# EAGLE design UMN_HASP_2015_Front_End_Board2 (EAGLE 6.5.0)

## Sheet 1 of 6: Channel 1
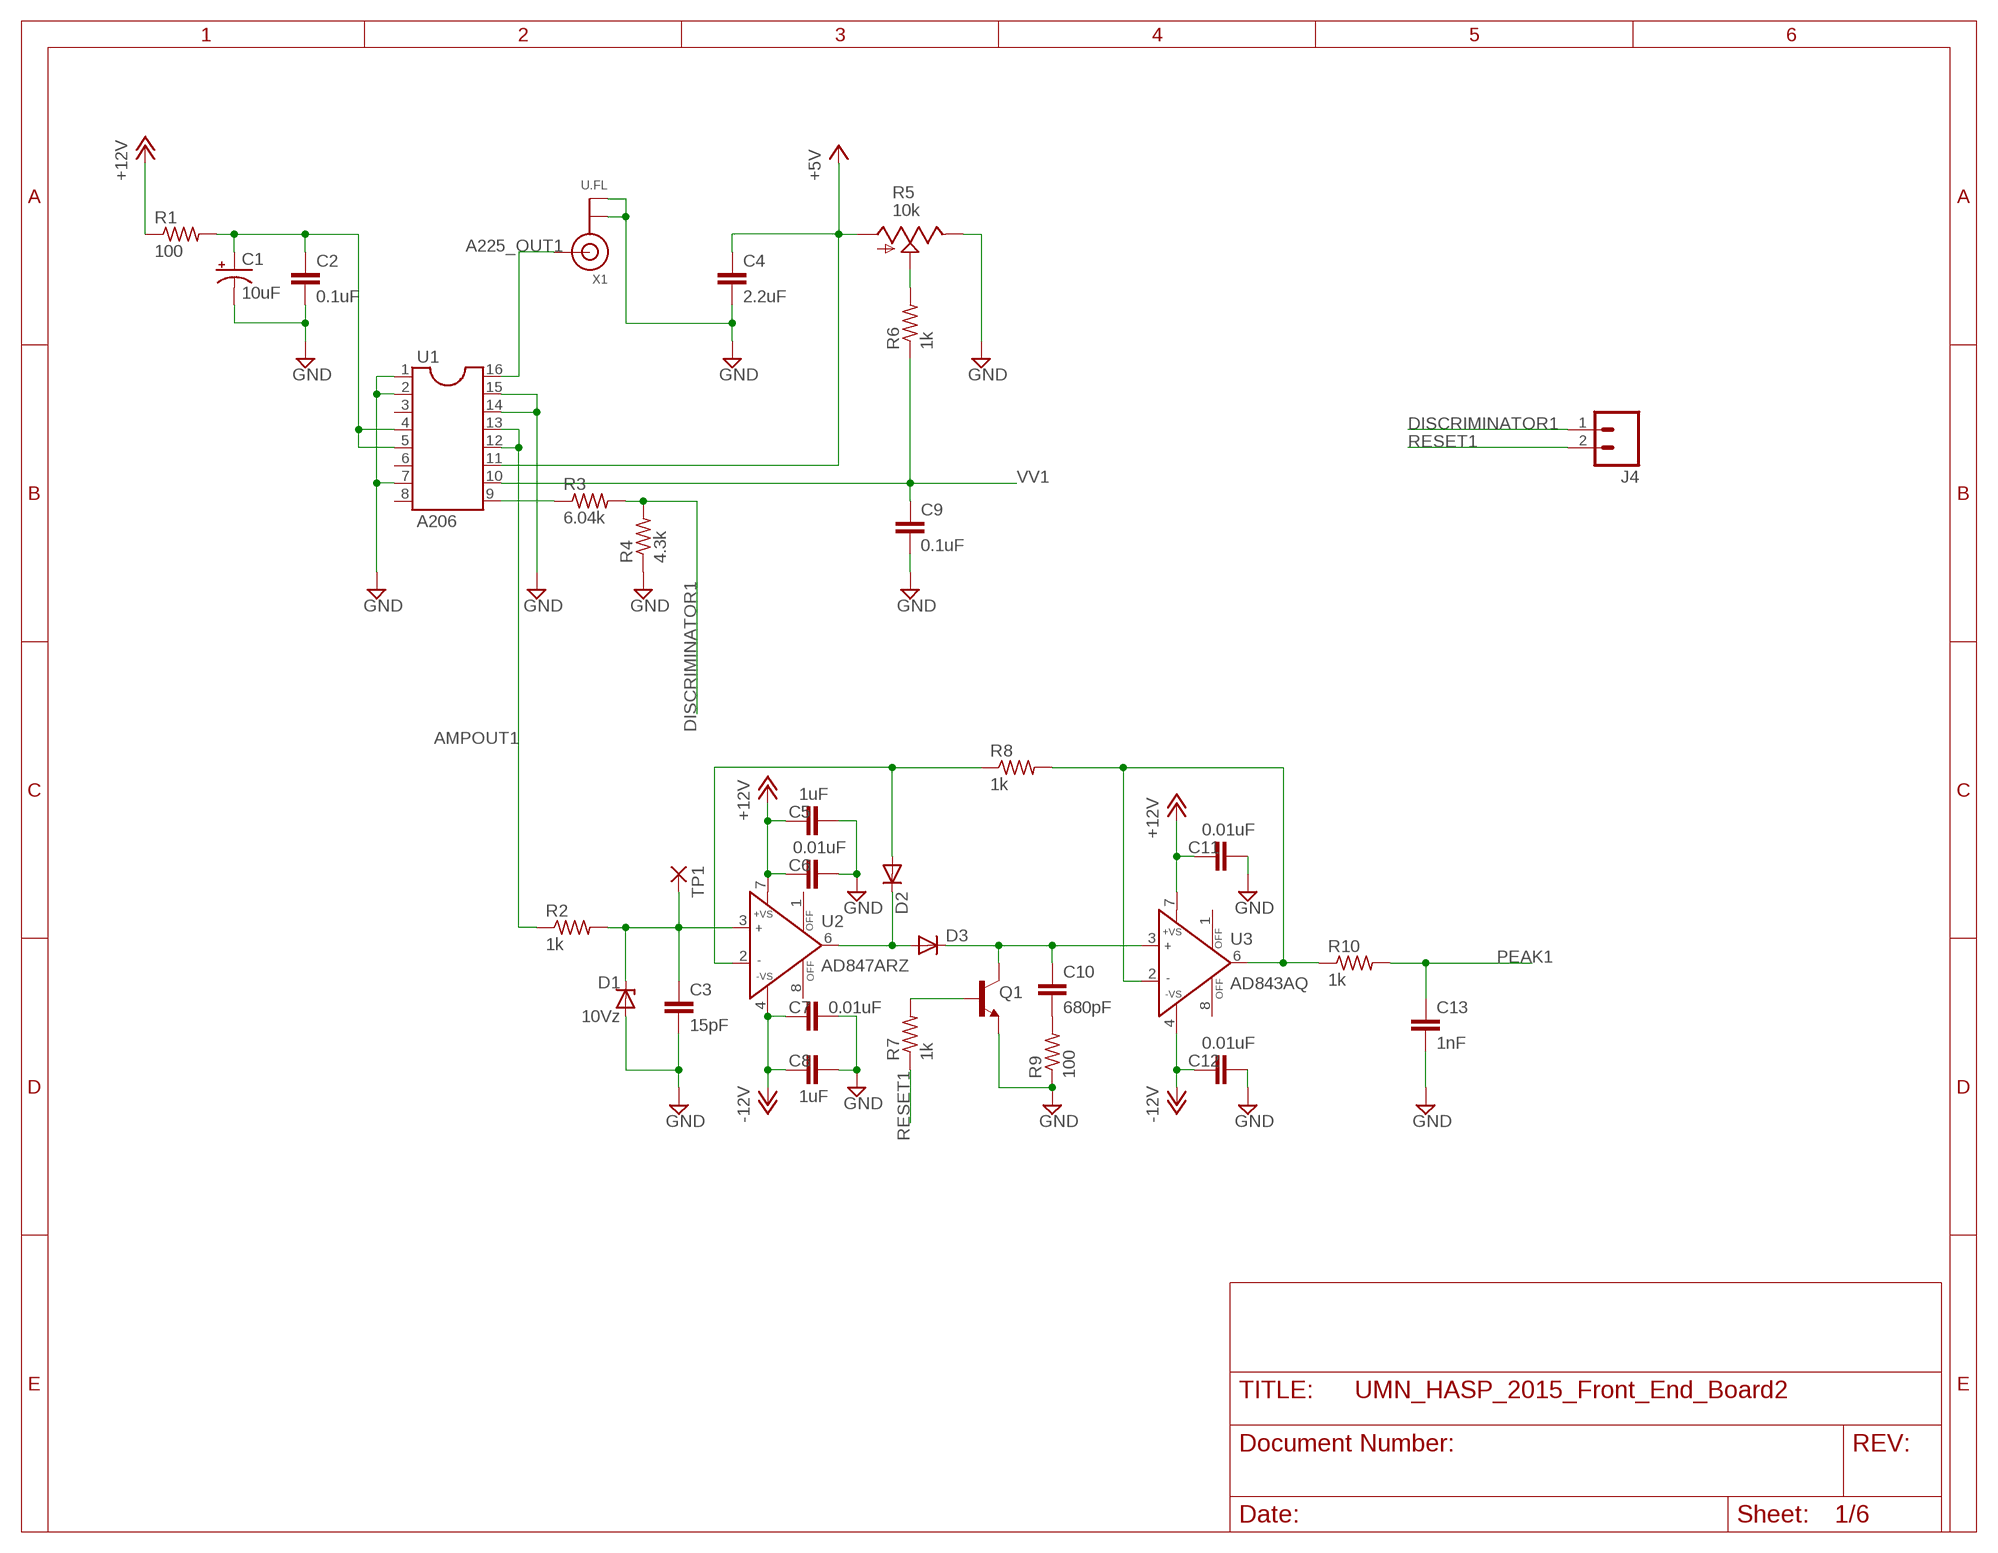
[diagram p0: schematic, sheet 1]

### Parts
C1  10uF  CPOL-USC/6032-28R  [C/6032-28R]
C2  0.1uF  C-EUC0603K  [C0603K]
C3  15pF  C-EUC0402K  [C0402K]
C4  2.2uF  C-EUC0603K  [C0603K]
C5  1uF  C-EUC0603K  [C0603K]
C6  0.01uF  C-EUC0402K  [C0402K]
C7  0.01uF  C-EUC0402K  [C0402K]
C8  1uF  C-EUC0603K  [C0603K]
C9  0.1uF  C-EUC0603K  [C0603K]
C10  680pF  C-EUC0402K  [C0402K]
C11  0.01uF  C-EUC0402K  [C0402K]
C12  0.01uF  C-EUC0402K  [C0402K]
C13  1nF  C-EUC0402K  [C0402K]
D1  10Vz  ZENER-DIODESOT23  [SOT23]
D2  DIODE-SOD323-R  [SOD323-R]
D3  DIODE-SOD323-R  [SOD323-R]
J4  M02PTH  [1X02]
Q1  -NPN-SOT23-EBC  [SOT23-EBC]
R1  100  R-US_R0603  [R0603]
R2  1k  R-US_R0603  [R0603]
R3  6.04k  R-US_R0603  [R0603]
R4  4.3k  R-US_R0603  [R0603]
R5  10k  TRIM_US-3223J  [3223J]
R6  1k  R-US_R0603  [R0603]
R7  1k  R-US_R0603  [R0603]
R8  1k  R-US_R0603  [R0603]
R9  100  R-US_R0603  [R0603]
R10  1k  R-US_R0402  [R0402]
TP1  SMD2  [SMD1,27-2,54]
U1  A206  DIL16S  [SOCKET-16]
U2  AD847ARZ  [SO8]
U3  AD843AQ  [DIL08]
X1  U.FL  ANTENNA_U.FL  [U.FL]

### Nets
+5V: C4.1 R5.1(A) U1.11 ; also sheet 2,3,4,5,6
+12V: C5.1 C6.1 C11.1 R1.1 U2.7(+VS) U3.7(+VS) ; also sheet 2,3,4,5,6
-12V: C7.1 C8.1 C12.1 U2.4(-VS) U3.4(-VS) ; also sheet 2,3,4,6
A225_OUT1: U1.16 X1.3(SIGNAL)
AMPOUT1: R2.1 U1.12 U1.13
DISCRIMINATOR1: J4.1 R3.2 R4.2
GND: C1.- C2.2 C3.2 C4.2 C5.2 C6.2 C7.2 C8.2 C9.2 C11.2 C12.2 C13.2 D1.1(A) Q1.E R4.1 R5.3(E) R9.1 U1.1 U1.2 U1.7 U1.14 U1.15 X1.1(GND) X1.2(GND) ; also sheet 2,3,4,5,6
N$9: C1.+ C2.1 R1.2 U1.4 U1.5
N$11: C3.1 D1.3(C) R2.2 TP1.1(P) U2.3(IN+)
N$12: R3.1 U1.9
N$13: D2.C D3.A U2.6(OUT)
N$14: R5.2(S) R6.2
N$15: D2.A R8.1 U2.2(IN-)
N$16: C10.1 D3.C Q1.C U3.3(IN+)
N$17: C10.2 R9.2
N$18: Q1.B R7.2
N$19: R8.2 R10.1 U3.2(IN-) U3.6(OUT)
PEAK1: C13.1 R10.2 ; also sheet 5
RESET1: J4.2 R7.1
VV1: C9.1 R6.1 U1.10
Unconnected: U1.3 U1.6 U1.8 U2.1(OFF) U2.8(OFF) U3.1(OFF) U3.8(OFF)

## Sheet 2 of 6: Channel 2
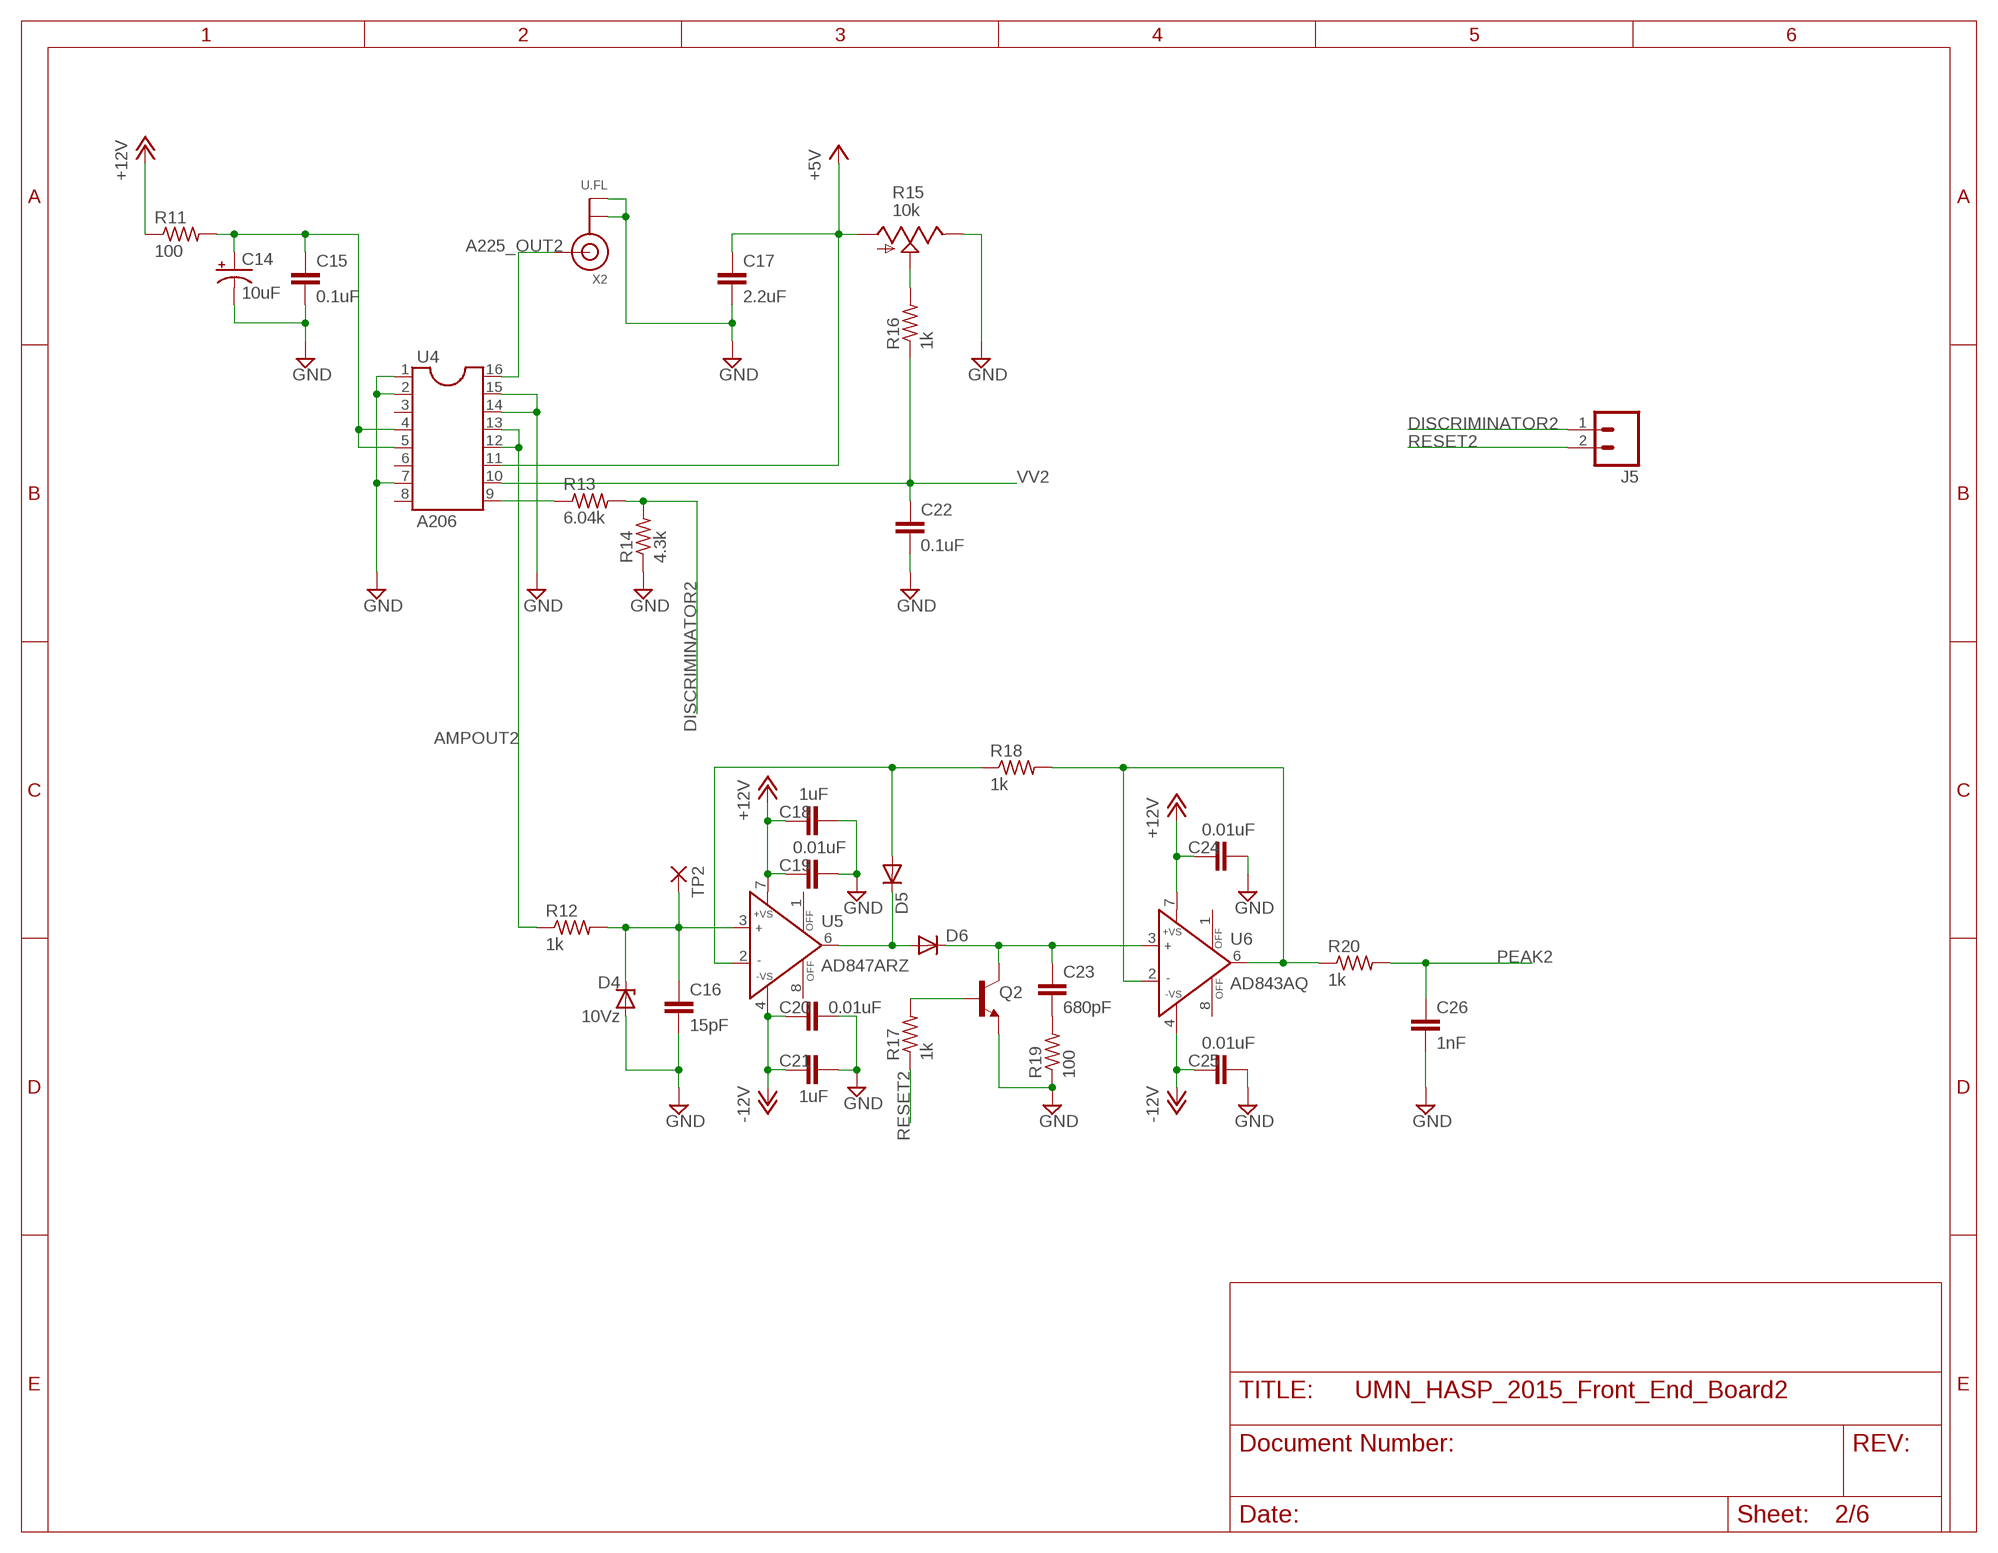
[diagram p1: schematic, sheet 2]

### Parts
C14  10uF  CPOL-USC/6032-28R  [C/6032-28R]
C15  0.1uF  C-EUC0603K  [C0603K]
C16  15pF  C-EUC0402K  [C0402K]
C17  2.2uF  C-EUC0603K  [C0603K]
C18  1uF  C-EUC0603K  [C0603K]
C19  0.01uF  C-EUC0402K  [C0402K]
C20  0.01uF  C-EUC0402K  [C0402K]
C21  1uF  C-EUC0603K  [C0603K]
C22  0.1uF  C-EUC0603K  [C0603K]
C23  680pF  C-EUC0402K  [C0402K]
C24  0.01uF  C-EUC0402K  [C0402K]
C25  0.01uF  C-EUC0402K  [C0402K]
C26  1nF  C-EUC0402K  [C0402K]
D4  10Vz  ZENER-DIODESOT23  [SOT23]
D5  DIODE-SOD323-R  [SOD323-R]
D6  DIODE-SOD323-R  [SOD323-R]
J5  M02PTH  [1X02]
Q2  -NPN-SOT23-EBC  [SOT23-EBC]
R11  100  R-US_R0603  [R0603]
R12  1k  R-US_R0603  [R0603]
R13  6.04k  R-US_R0603  [R0603]
R14  4.3k  R-US_R0603  [R0603]
R15  10k  TRIM_US-3223J  [3223J]
R16  1k  R-US_R0603  [R0603]
R17  1k  R-US_R0603  [R0603]
R18  1k  R-US_R0603  [R0603]
R19  100  R-US_R0603  [R0603]
R20  1k  R-US_R0402  [R0402]
TP2  SMD2  [SMD1,27-2,54]
U4  A206  DIL16S  [SOCKET-16]
U5  AD847ARZ  [SO8]
U6  AD843AQ  [DIL08]
X2  U.FL  ANTENNA_U.FL  [U.FL]

### Nets
+5V: C17.1 R15.1(A) U4.11 ; also sheet 1,3,4,5,6
+12V: C18.1 C19.1 C24.1 R11.1 U5.7(+VS) U6.7(+VS) ; also sheet 1,3,4,5,6
-12V: C20.1 C21.1 C25.1 U5.4(-VS) U6.4(-VS) ; also sheet 1,3,4,6
A225_OUT2: U4.16 X2.3(SIGNAL)
AMPOUT2: R12.1 U4.12 U4.13
DISCRIMINATOR2: J5.1 R13.2 R14.2
GND: C14.- C15.2 C16.2 C17.2 C18.2 C19.2 C20.2 C21.2 C22.2 C24.2 C25.2 C26.2 D4.1(A) Q2.E R14.1 R15.3(E) R19.1 U4.1 U4.2 U4.7 U4.14 U4.15 X2.1(GND) X2.2(GND) ; also sheet 1,3,4,5,6
N$1: C14.+ C15.1 R11.2 U4.4 U4.5
N$2: R13.1 U4.9
N$3: R15.2(S) R16.2
N$20: C16.1 D4.3(C) R12.2 TP2.1(P) U5.3(IN+)
N$21: D5.C D6.A U5.6(OUT)
N$22: D5.A R18.1 U5.2(IN-)
N$23: C23.1 D6.C Q2.C U6.3(IN+)
N$24: C23.2 R19.2
N$25: Q2.B R17.2
N$26: R18.2 R20.1 U6.2(IN-) U6.6(OUT)
PEAK2: C26.1 R20.2 ; also sheet 5
RESET2: J5.2 R17.1
VV2: C22.1 R16.1 U4.10
Unconnected: U4.3 U4.6 U4.8 U5.1(OFF) U5.8(OFF) U6.1(OFF) U6.8(OFF)

## Sheet 3 of 6: Channel 3
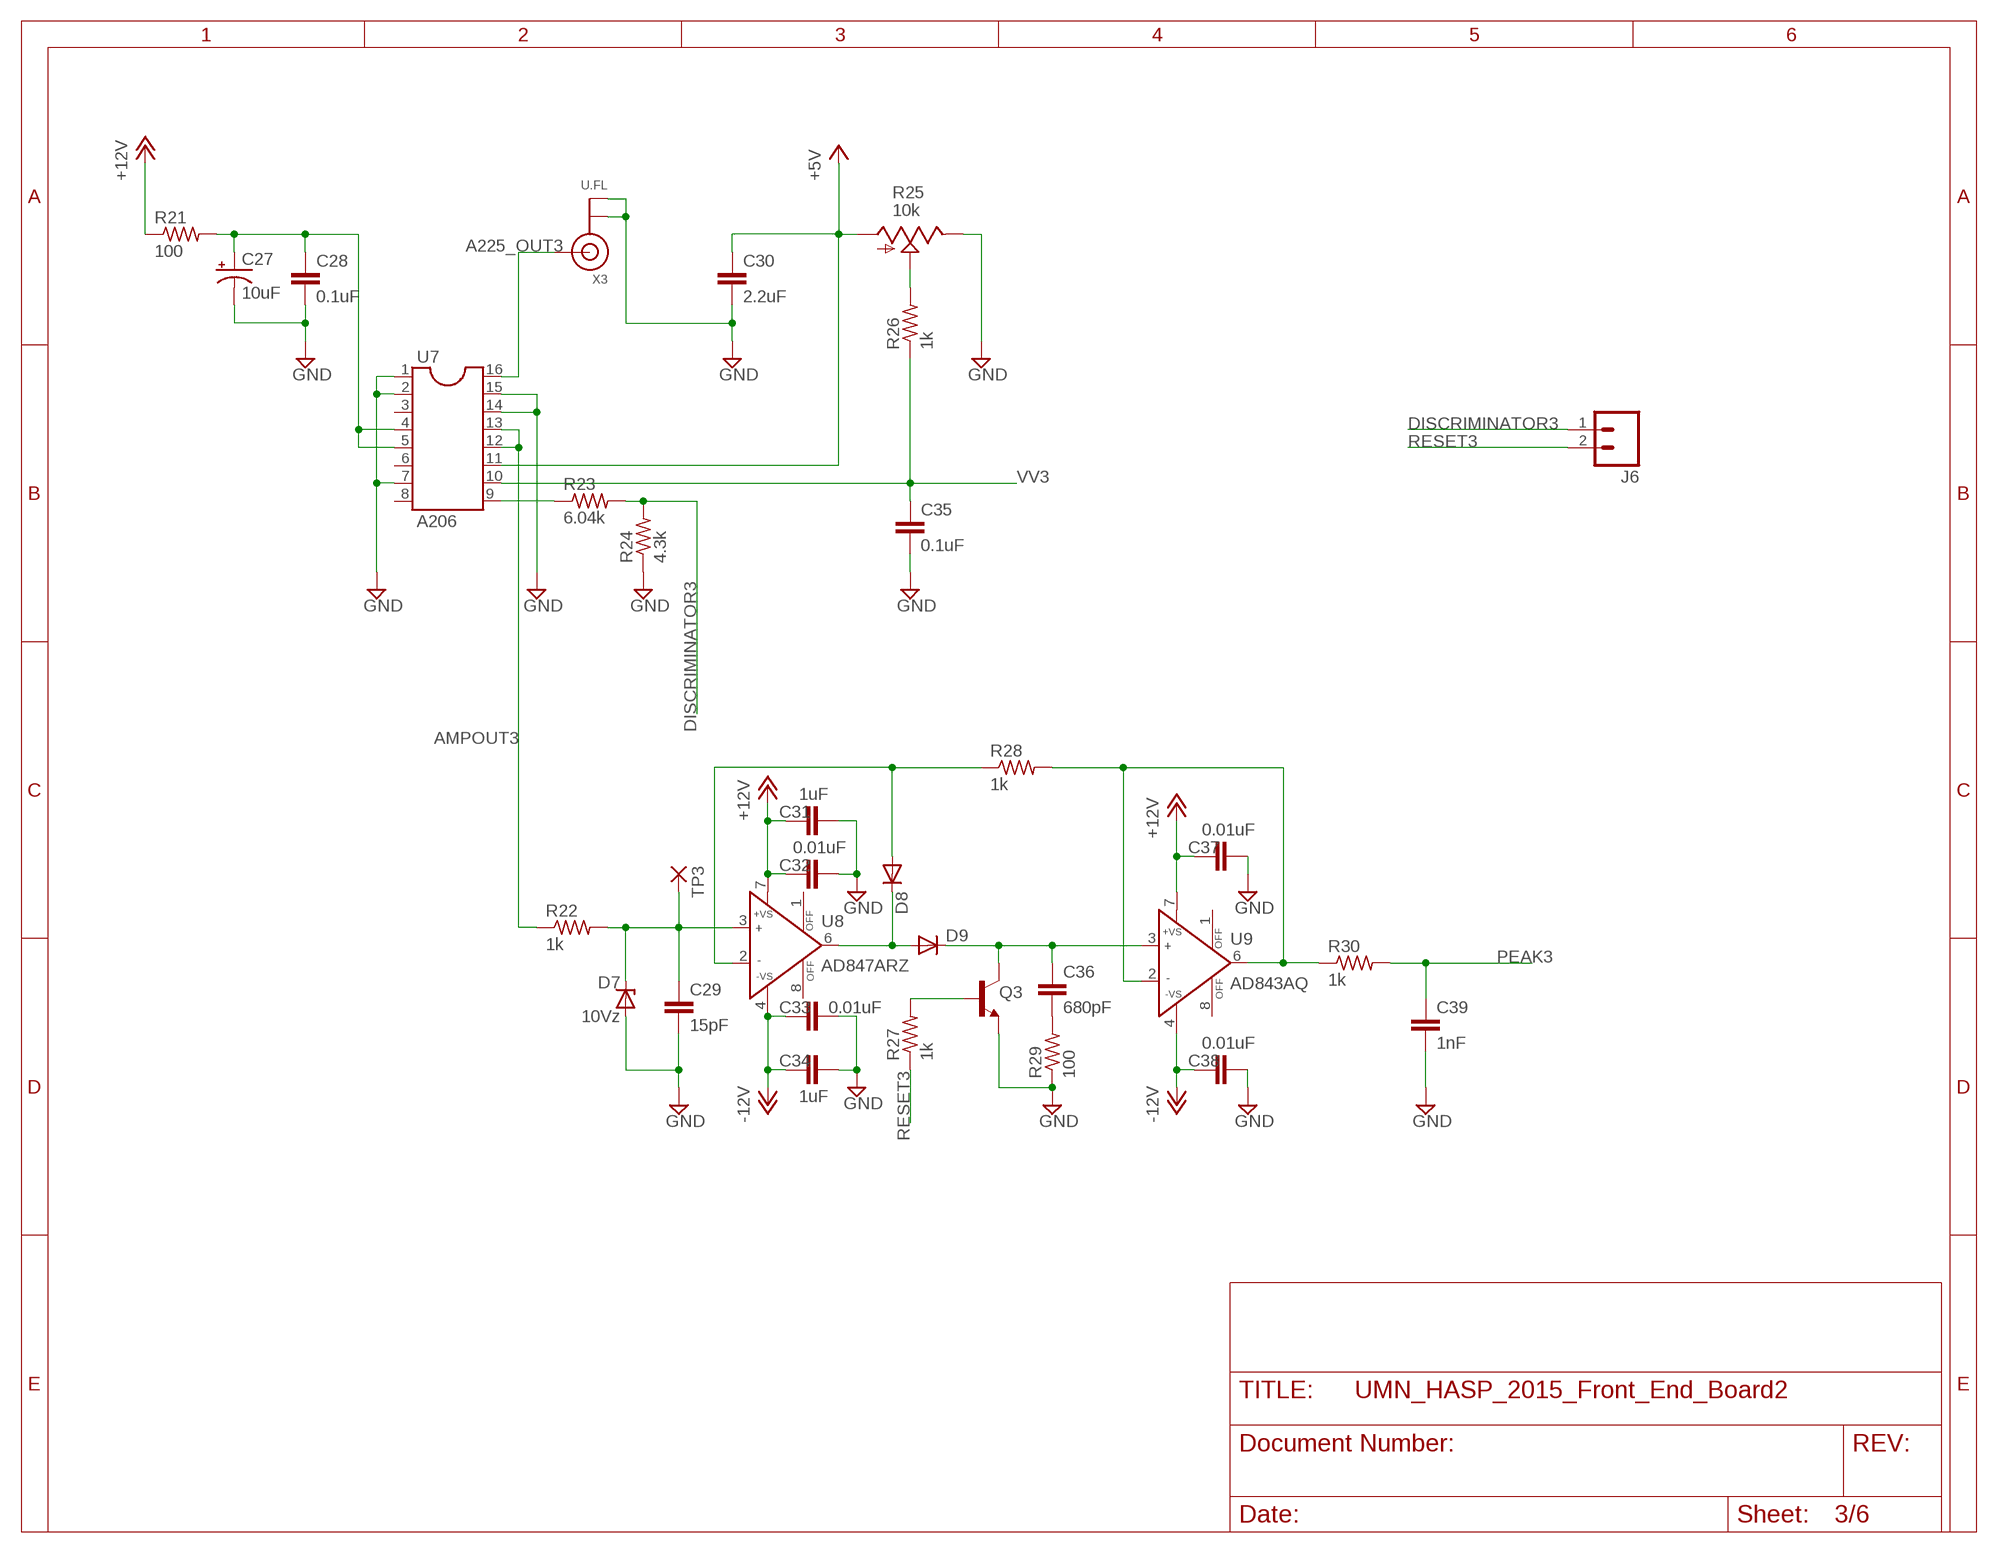
[diagram p2: schematic, sheet 3]

### Parts
C27  10uF  CPOL-USC/6032-28R  [C/6032-28R]
C28  0.1uF  C-EUC0603K  [C0603K]
C29  15pF  C-EUC0402K  [C0402K]
C30  2.2uF  C-EUC0603K  [C0603K]
C31  1uF  C-EUC0603K  [C0603K]
C32  0.01uF  C-EUC0402K  [C0402K]
C33  0.01uF  C-EUC0402K  [C0402K]
C34  1uF  C-EUC0603K  [C0603K]
C35  0.1uF  C-EUC0603K  [C0603K]
C36  680pF  C-EUC0402K  [C0402K]
C37  0.01uF  C-EUC0402K  [C0402K]
C38  0.01uF  C-EUC0402K  [C0402K]
C39  1nF  C-EUC0402K  [C0402K]
D7  10Vz  ZENER-DIODESOT23  [SOT23]
D8  DIODE-SOD323-R  [SOD323-R]
D9  DIODE-SOD323-R  [SOD323-R]
J6  M02PTH  [1X02]
Q3  -NPN-SOT23-EBC  [SOT23-EBC]
R21  100  R-US_R0603  [R0603]
R22  1k  R-US_R0603  [R0603]
R23  6.04k  R-US_R0603  [R0603]
R24  4.3k  R-US_R0603  [R0603]
R25  10k  TRIM_US-3223J  [3223J]
R26  1k  R-US_R0603  [R0603]
R27  1k  R-US_R0603  [R0603]
R28  1k  R-US_R0603  [R0603]
R29  100  R-US_R0603  [R0603]
R30  1k  R-US_R0402  [R0402]
TP3  SMD2  [SMD1,27-2,54]
U7  A206  DIL16S  [SOCKET-16]
U8  AD847ARZ  [SO8]
U9  AD843AQ  [DIL08]
X3  U.FL  ANTENNA_U.FL  [U.FL]

### Nets
+5V: C30.1 R25.1(A) U7.11 ; also sheet 1,2,4,5,6
+12V: C31.1 C32.1 C37.1 R21.1 U8.7(+VS) U9.7(+VS) ; also sheet 1,2,4,5,6
-12V: C33.1 C34.1 C38.1 U8.4(-VS) U9.4(-VS) ; also sheet 1,2,4,6
A225_OUT3: U7.16 X3.3(SIGNAL)
AMPOUT3: R22.1 U7.12 U7.13
DISCRIMINATOR3: J6.1 R23.2 R24.2
GND: C27.- C28.2 C29.2 C30.2 C31.2 C32.2 C33.2 C34.2 C35.2 C37.2 C38.2 C39.2 D7.1(A) Q3.E R24.1 R25.3(E) R29.1 U7.1 U7.2 U7.7 U7.14 U7.15 X3.1(GND) X3.2(GND) ; also sheet 1,2,4,5,6
N$4: C27.+ C28.1 R21.2 U7.4 U7.5
N$5: R23.1 U7.9
N$6: R25.2(S) R26.2
N$27: C29.1 D7.3(C) R22.2 TP3.1(P) U8.3(IN+)
N$28: D8.C D9.A U8.6(OUT)
N$29: D8.A R28.1 U8.2(IN-)
N$30: C36.1 D9.C Q3.C U9.3(IN+)
N$31: C36.2 R29.2
N$32: Q3.B R27.2
N$33: R28.2 R30.1 U9.2(IN-) U9.6(OUT)
PEAK3: C39.1 R30.2 ; also sheet 5
RESET3: J6.2 R27.1
VV3: C35.1 R26.1 U7.10
Unconnected: U7.3 U7.6 U7.8 U8.1(OFF) U8.8(OFF) U9.1(OFF) U9.8(OFF)

## Sheet 4 of 6: Channel 4
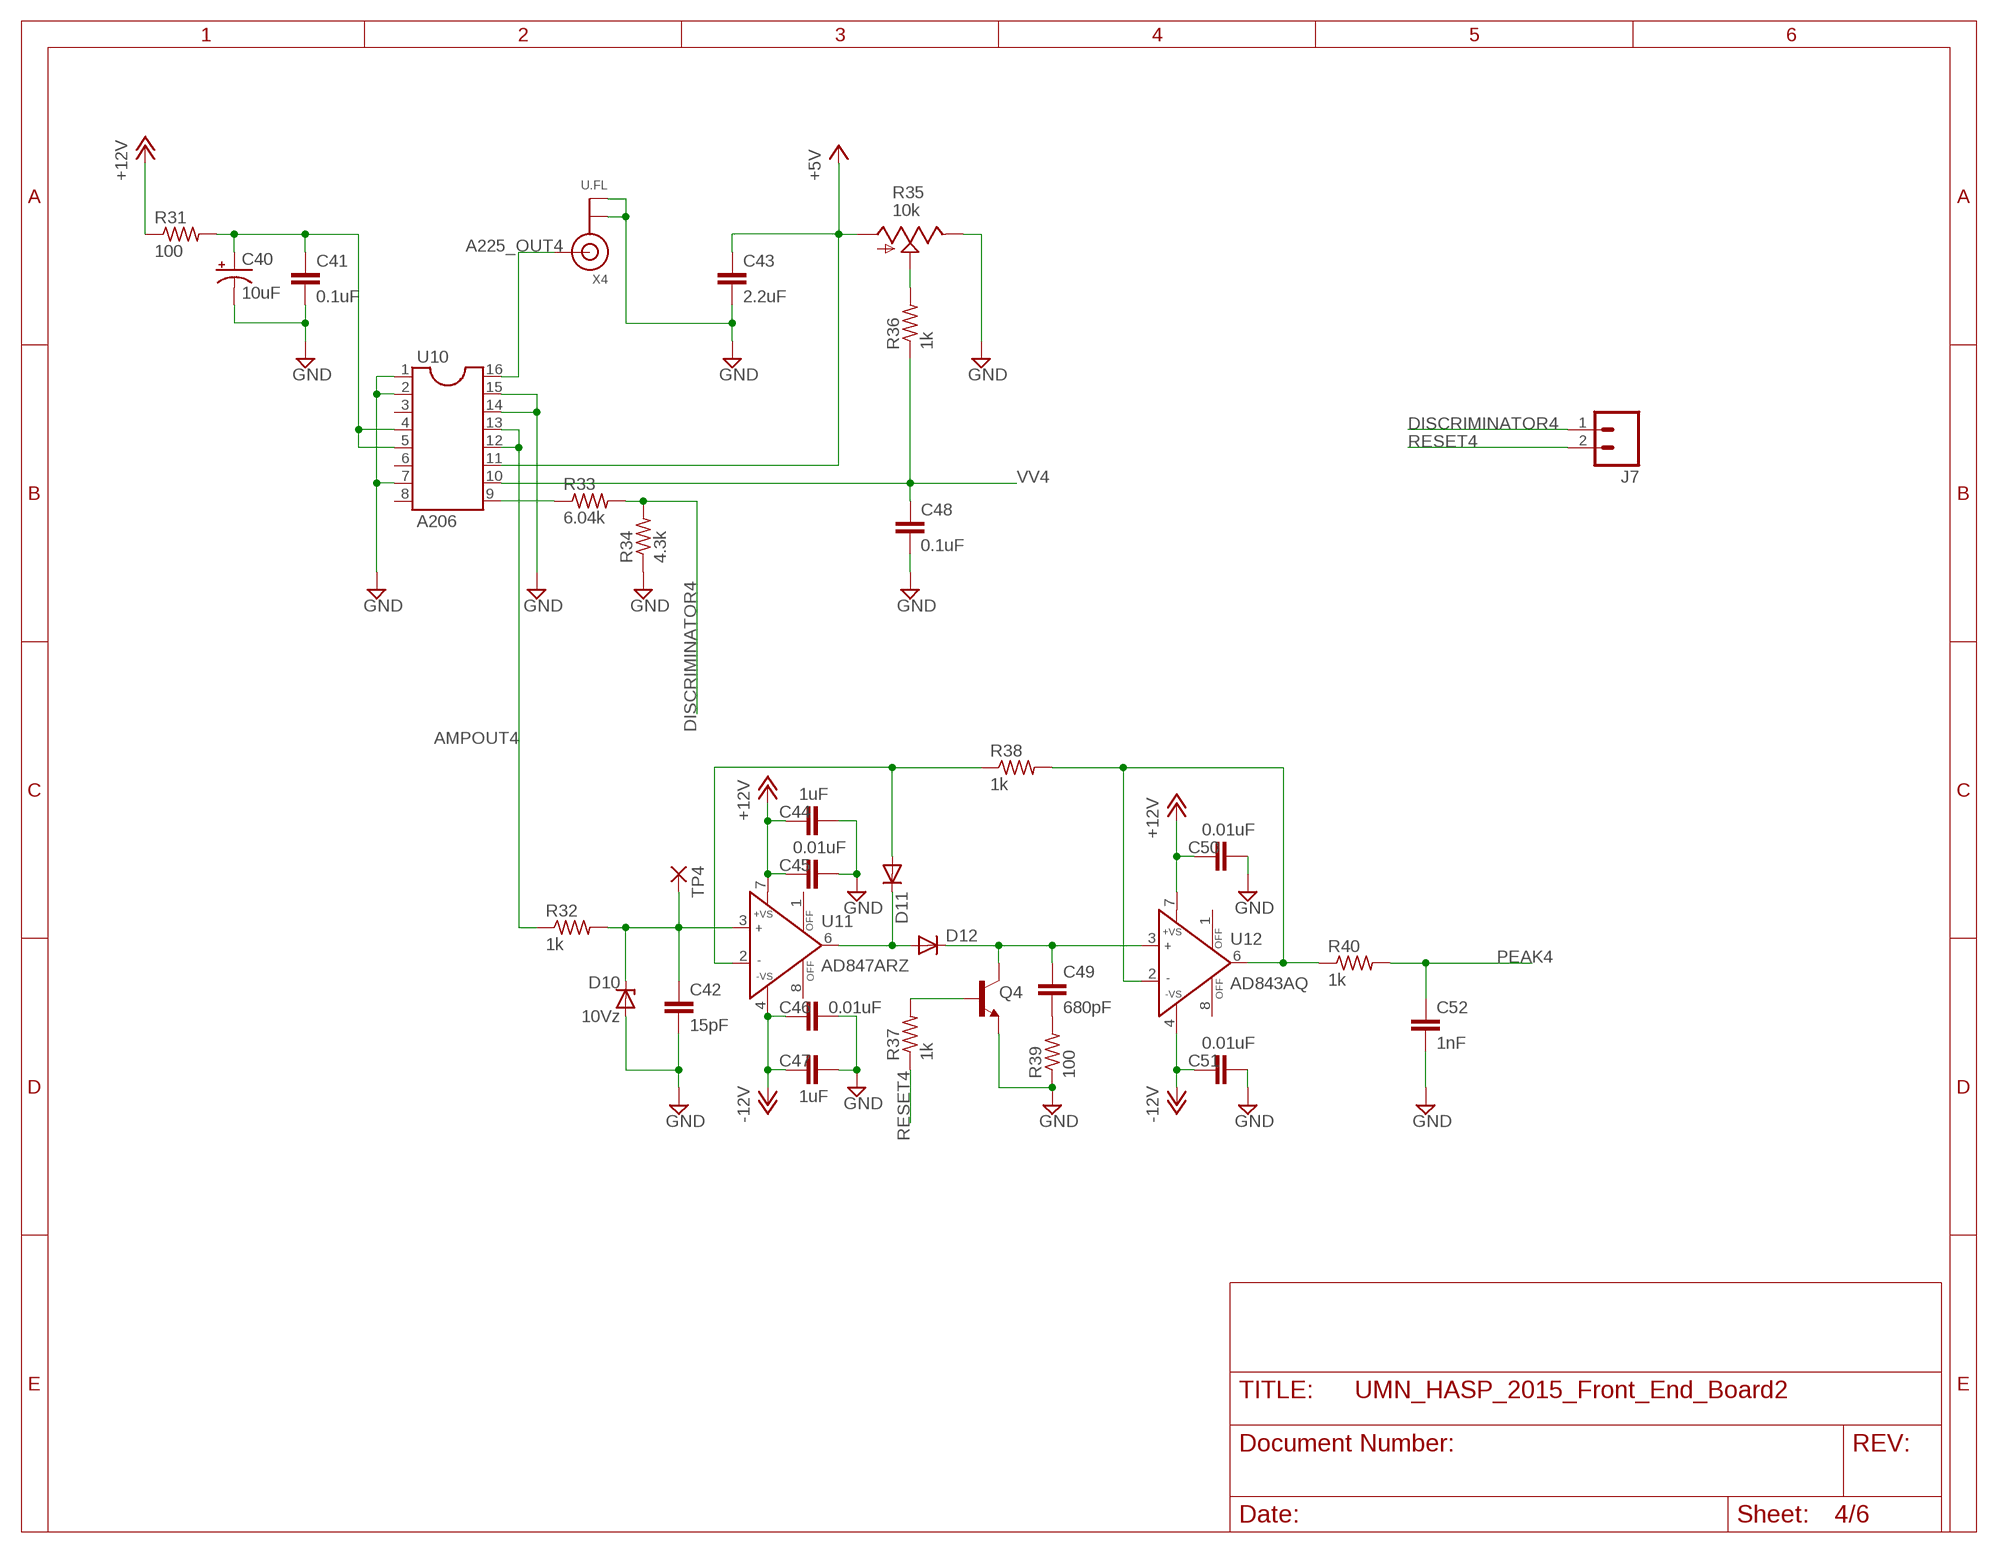
[diagram p3: schematic, sheet 4]

### Parts
C40  10uF  CPOL-USC/6032-28R  [C/6032-28R]
C41  0.1uF  C-EUC0603K  [C0603K]
C42  15pF  C-EUC0402K  [C0402K]
C43  2.2uF  C-EUC0603K  [C0603K]
C44  1uF  C-EUC0603K  [C0603K]
C45  0.01uF  C-EUC0402K  [C0402K]
C46  0.01uF  C-EUC0402K  [C0402K]
C47  1uF  C-EUC0603K  [C0603K]
C48  0.1uF  C-EUC0603K  [C0603K]
C49  680pF  C-EUC0402K  [C0402K]
C50  0.01uF  C-EUC0402K  [C0402K]
C51  0.01uF  C-EUC0402K  [C0402K]
C52  1nF  C-EUC0402K  [C0402K]
D10  10Vz  ZENER-DIODESOT23  [SOT23]
D11  DIODE-SOD323-R  [SOD323-R]
D12  DIODE-SOD323-R  [SOD323-R]
J7  M02PTH  [1X02]
Q4  -NPN-SOT23-EBC  [SOT23-EBC]
R31  100  R-US_R0603  [R0603]
R32  1k  R-US_R0603  [R0603]
R33  6.04k  R-US_R0603  [R0603]
R34  4.3k  R-US_R0603  [R0603]
R35  10k  TRIM_US-3223J  [3223J]
R36  1k  R-US_R0603  [R0603]
R37  1k  R-US_R0603  [R0603]
R38  1k  R-US_R0603  [R0603]
R39  100  R-US_R0603  [R0603]
R40  1k  R-US_R0402  [R0402]
TP4  SMD2  [SMD1,27-2,54]
U10  A206  DIL16S  [SOCKET-16]
U11  AD847ARZ  [SO8]
U12  AD843AQ  [DIL08]
X4  U.FL  ANTENNA_U.FL  [U.FL]

### Nets
+5V: C43.1 R35.1(A) U10.11 ; also sheet 1,2,3,5,6
+12V: C44.1 C45.1 C50.1 R31.1 U11.7(+VS) U12.7(+VS) ; also sheet 1,2,3,5,6
-12V: C46.1 C47.1 C51.1 U11.4(-VS) U12.4(-VS) ; also sheet 1,2,3,6
A225_OUT4: U10.16 X4.3(SIGNAL)
AMPOUT4: R32.1 U10.12 U10.13
DISCRIMINATOR4: J7.1 R33.2 R34.2
GND: C40.- C41.2 C42.2 C43.2 C44.2 C45.2 C46.2 C47.2 C48.2 C50.2 C51.2 C52.2 D10.1(A) Q4.E R34.1 R35.3(E) R39.1 U10.1 U10.2 U10.7 U10.14 U10.15 X4.1(GND) X4.2(GND) ; also sheet 1,2,3,5,6
N$7: C40.+ C41.1 R31.2 U10.4 U10.5
N$8: R33.1 U10.9
N$10: R35.2(S) R36.2
N$34: C42.1 D10.3(C) R32.2 TP4.1(P) U11.3(IN+)
N$35: D11.C D12.A U11.6(OUT)
N$36: D11.A R38.1 U11.2(IN-)
N$37: C49.1 D12.C Q4.C U12.3(IN+)
N$38: C49.2 R39.2
N$39: Q4.B R37.2
N$40: R38.2 R40.1 U12.2(IN-) U12.6(OUT)
PEAK4: C52.1 R40.2 ; also sheet 5
RESET4: J7.2 R37.1
VV4: C48.1 R36.1 U10.10
Unconnected: U10.3 U10.6 U10.8 U11.1(OFF) U11.8(OFF) U12.1(OFF) U12.8(OFF)

## Sheet 5 of 6: A/D Converter
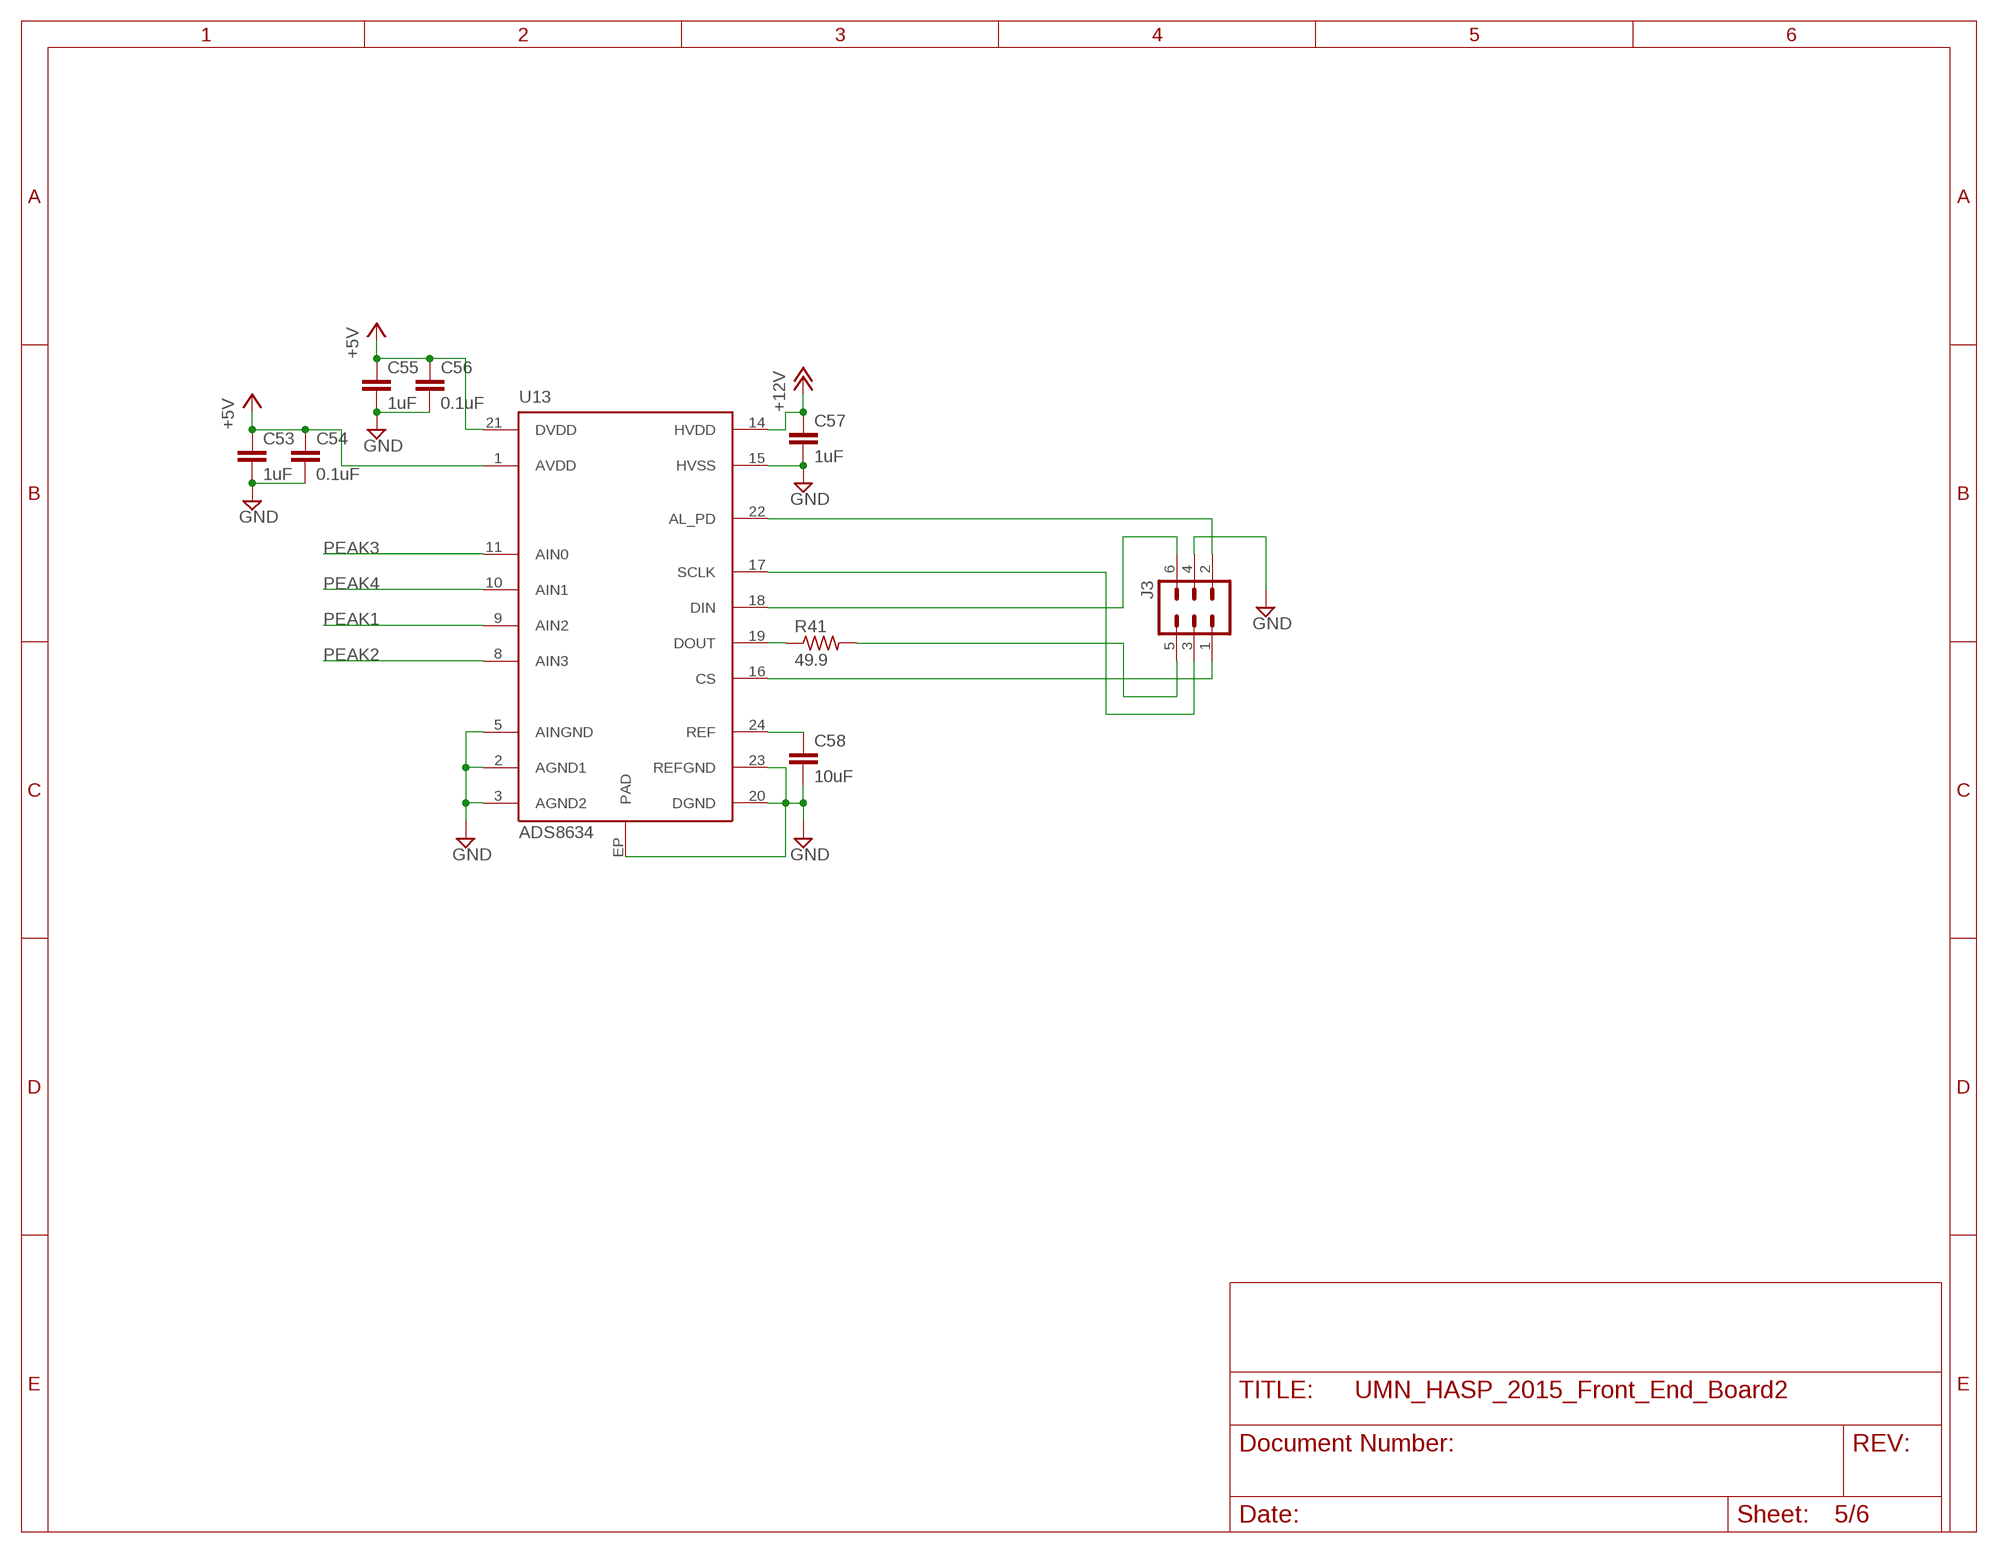
[diagram p4: schematic, sheet 5]

### Parts
C53  1uF  C-EUC0402K  [C0402K]
C54  0.1uF  C-EUC0402K  [C0402K]
C55  1uF  C-EUC0402K  [C0402K]
C56  0.1uF  C-EUC0402K  [C0402K]
C57  1uF  C-EUC0402K  [C0402K]
C58  10uF  C-EUC0603K  [C0603K]
J3  MA03-2  [MA03-2]
R41  49.9  R-US_R0402  [R0402]
U13  ADS8634  [QFN24]

### Nets
+5V: C53.1 C54.1 C55.1 C56.1 U13.1(AVDD) U13.21(DVDD) ; also sheet 1,2,3,4,6
+12V: C57.1 U13.14(HVDD) ; also sheet 1,2,3,4,6
AL_PD: J3.2 U13.22(AL_PD)
CS: J3.1 U13.16(CS)
DIN: J3.6 U13.18(DIN)
DOUT: J3.5 R41.2
GND: C53.2 C54.2 C55.2 C56.2 C57.2 C58.2 J3.4 U13.2(AGND1) U13.3(AGND2) U13.5(AINGND) U13.15(HVSS) U13.20(DGND) U13.23(REFGND) U13.EP(PAD) ; also sheet 1,2,3,4,6
N$47: R41.1 U13.19(DOUT)
PEAK1: U13.9(AIN2) ; also sheet 1
PEAK2: U13.8(AIN3) ; also sheet 2
PEAK3: U13.11(AIN0) ; also sheet 3
PEAK4: U13.10(AIN1) ; also sheet 4
REF: C58.1 U13.24(REF)
SCLK: J3.3 U13.17(SCLK)

## Sheet 6 of 6: PC/104
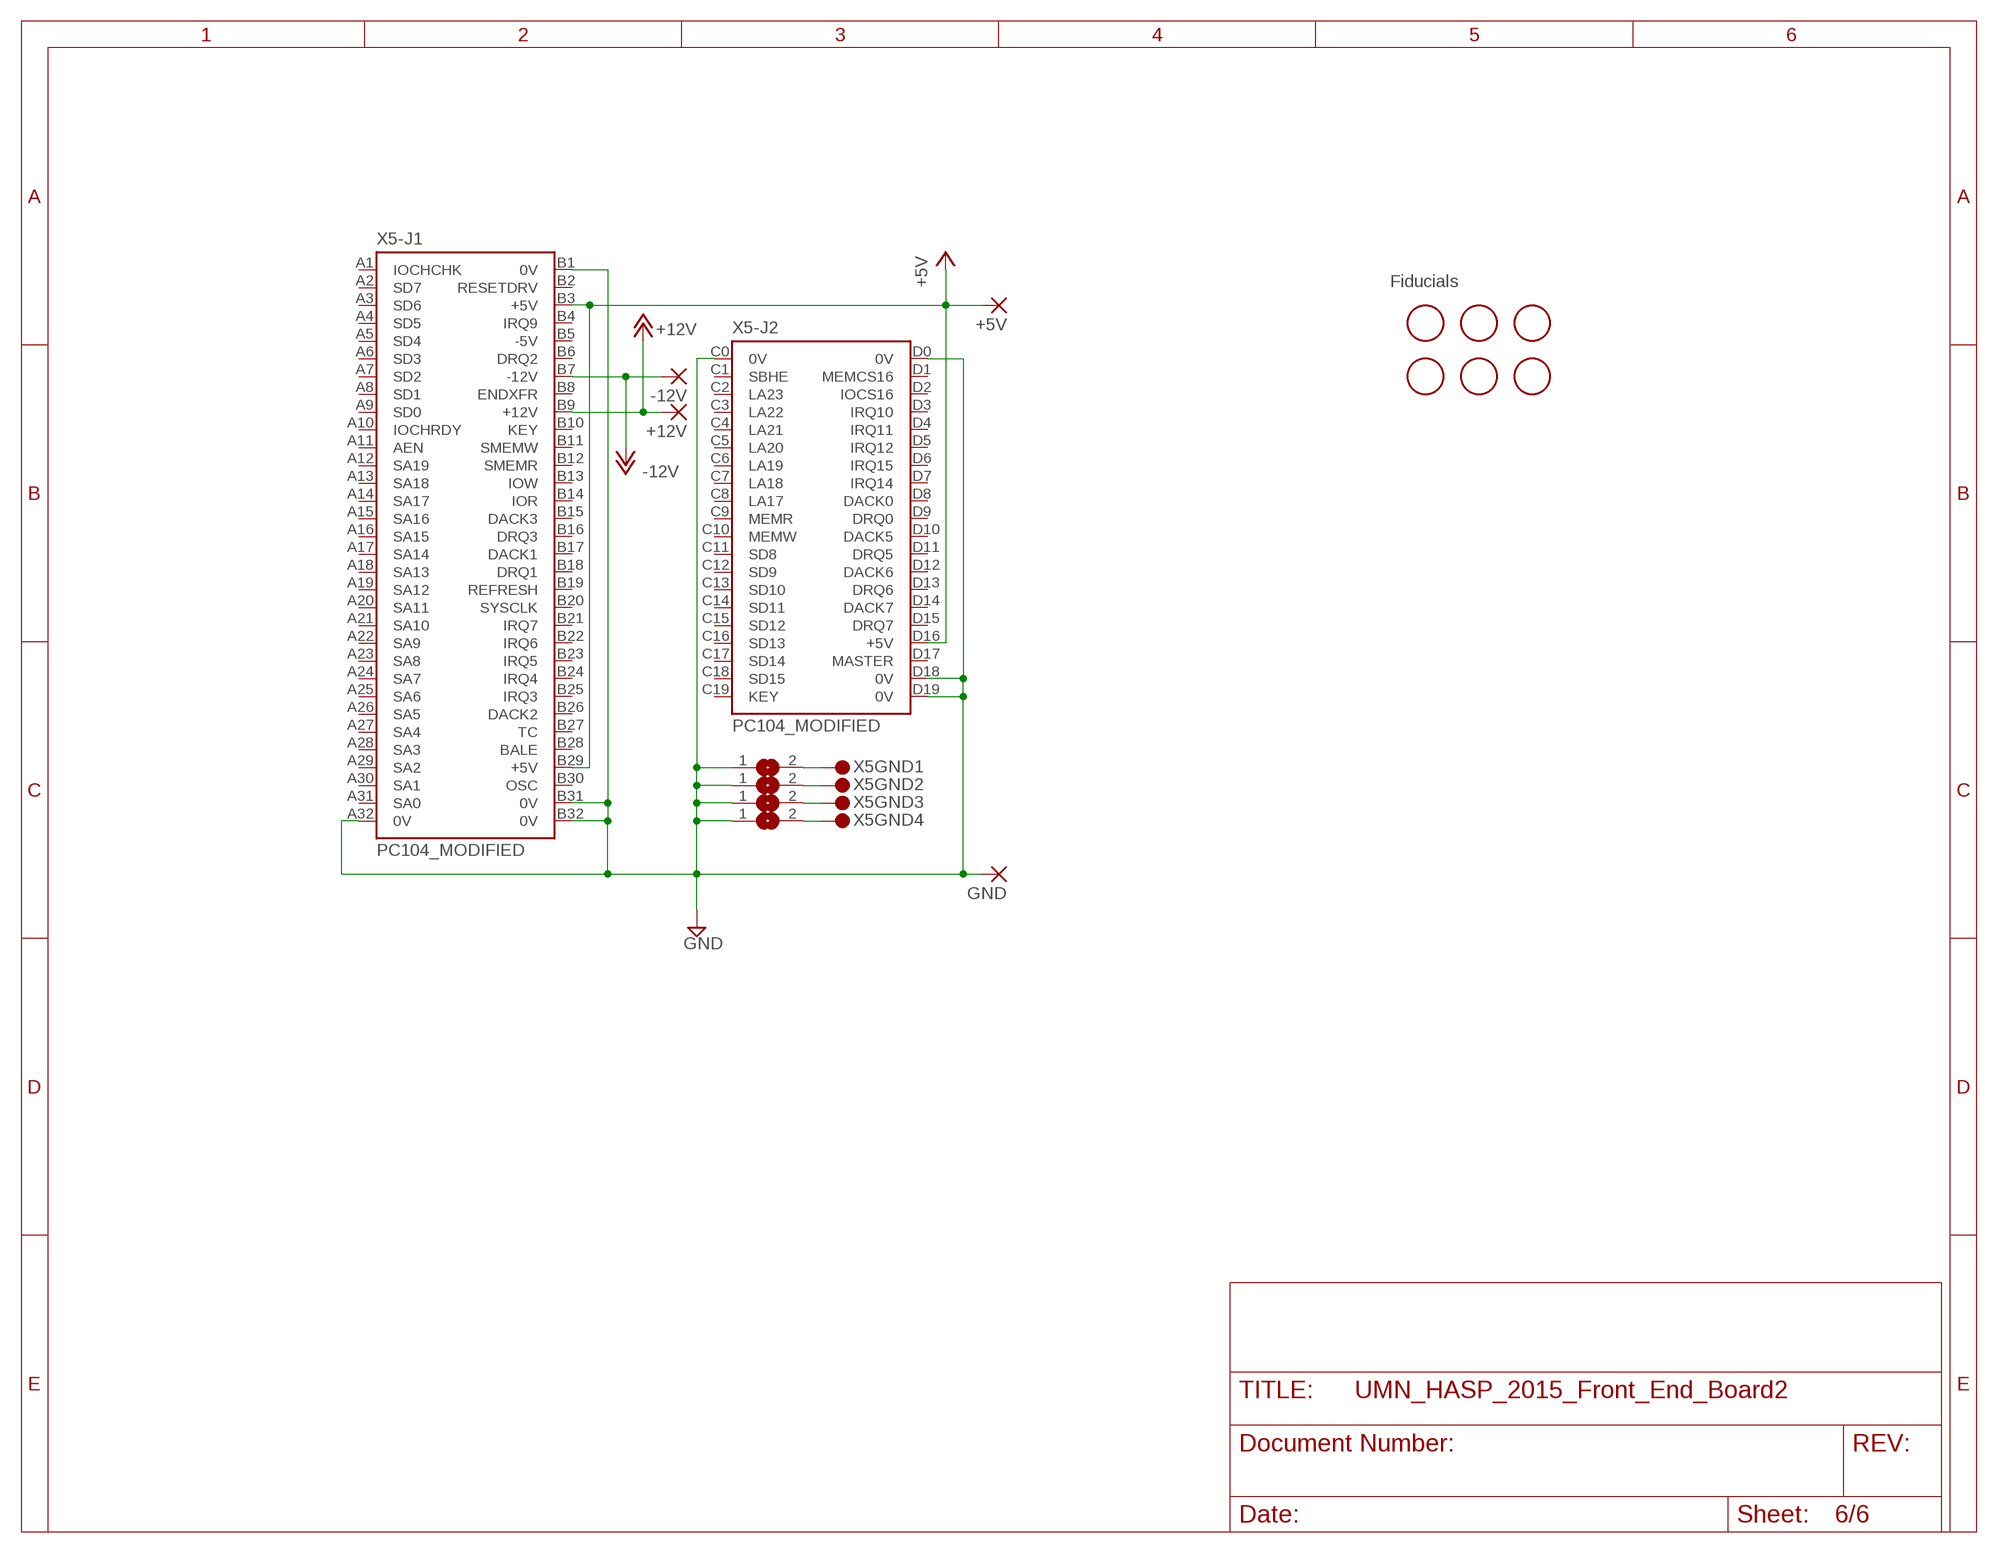
[diagram p5: schematic, sheet 6]

### Parts
+5V  SMD2  [SMD1,27-2,54]
+12V  SMD2  [SMD1,27-2,54]
-12V  SMD2  [SMD1,27-2,54]
F1  FIDUCIAL  [FIDUCIAL_1MM]
F2  FIDUCIAL  [FIDUCIAL_1MM]
F3  FIDUCIAL  [FIDUCIAL_1MM]
F4  FIDUCIAL  [FIDUCIAL_1MM]
F5  FIDUCIAL  [FIDUCIAL_1MM]
F6  FIDUCIAL  [FIDUCIAL_1MM]
GND  SMD2  [SMD1,27-2,54]
SJ1  SJ  [SJ]
SJ2  SJ  [SJ]
SJ3  SJ  [SJ]
SJ4  SJ  [SJ]
X5  PC104_MODIFIED  [PC104_MODIFIED]

### Nets
+5V: +5V.1(P) X5.B3(-J1:+5V) X5.B29(-J1:+5V) X5.D16(-J2:+5V) ; also sheet 1,2,3,4,5
+12V: +12V.1(P) X5.B9(-J1:+12V) ; also sheet 1,2,3,4,5
-12V: -12V.1(P) X5.B7(-J1:-12V) ; also sheet 1,2,3,4
GND: GND.1(P) SJ1.1 SJ2.1 SJ3.1 SJ4.1 X5.A32(-J1:0V) X5.B1(-J1:0V) X5.B31(-J1:0V) X5.B32(-J1:0V) X5.C0(-J2:0V) X5.D0(-J2:0V) X5.D18(-J2:0V) X5.D19(-J2:0V) ; also sheet 1,2,3,4,5
N$43: SJ1.2 X5.GND@1
N$44: SJ2.2 X5.GND@2
N$45: SJ3.2 X5.GND@3
N$46: SJ4.2 X5.GND@4
Unconnected: X5.A1(-J1:IOCHCHK) X5.A2(-J1:SD7) X5.A3(-J1:SD6) X5.A4(-J1:SD5) X5.A5(-J1:SD4) X5.A6(-J1:SD3) X5.A7(-J1:SD2) X5.A8(-J1:SD1) X5.A9(-J1:SD0) X5.A10(-J1:IOCHRDY) X5.A11(-J1:AEN) X5.A12(-J1:SA19) X5.A13(-J1:SA18) X5.A14(-J1:SA17) X5.A15(-J1:SA16) X5.A16(-J1:SA15) X5.A17(-J1:SA14) X5.A18(-J1:SA13) X5.A19(-J1:SA12) X5.A20(-J1:SA11) X5.A21(-J1:SA10) X5.A22(-J1:SA9) X5.A23(-J1:SA8) X5.A24(-J1:SA7) X5.A25(-J1:SA6) X5.A26(-J1:SA5) X5.A27(-J1:SA4) X5.A28(-J1:SA3) X5.A29(-J1:SA2) X5.A30(-J1:SA1) X5.A31(-J1:SA0) X5.B2(-J1:RESETDRV) X5.B4(-J1:IRQ9) X5.B5(-J1:-5V) X5.B6(-J1:DRQ2) X5.B8(-J1:ENDXFR) X5.B10(-J1:KEY) X5.B11(-J1:SMEMW) X5.B12(-J1:SMEMR) X5.B13(-J1:IOW) X5.B14(-J1:IOR) X5.B15(-J1:DACK3) X5.B16(-J1:DRQ3) X5.B17(-J1:DACK1) X5.B18(-J1:DRQ1) X5.B19(-J1:REFRESH) X5.B20(-J1:SYSCLK) X5.B21(-J1:IRQ7) X5.B22(-J1:IRQ6) X5.B23(-J1:IRQ5) X5.B24(-J1:IRQ4) X5.B25(-J1:IRQ3) X5.B26(-J1:DACK2) X5.B27(-J1:TC) X5.B28(-J1:BALE) X5.B30(-J1:OSC) X5.C1(-J2:SBHE) X5.C2(-J2:LA23) X5.C3(-J2:LA22) X5.C4(-J2:LA21) X5.C5(-J2:LA20) X5.C6(-J2:LA19) X5.C7(-J2:LA18) X5.C8(-J2:LA17) X5.C9(-J2:MEMR) X5.C10(-J2:MEMW) X5.C11(-J2:SD8) X5.C12(-J2:SD9) X5.C13(-J2:SD10) X5.C14(-J2:SD11) X5.C15(-J2:SD12) X5.C16(-J2:SD13) X5.C17(-J2:SD14) X5.C18(-J2:SD15) X5.C19(-J2:KEY) X5.D1(-J2:MEMCS16) X5.D2(-J2:IOCS16) X5.D3(-J2:IRQ10) X5.D4(-J2:IRQ11) X5.D5(-J2:IRQ12) X5.D6(-J2:IRQ15) X5.D7(-J2:IRQ14) X5.D8(-J2:DACK0) X5.D9(-J2:DRQ0) X5.D10(-J2:DACK5) X5.D11(-J2:DRQ5) X5.D12(-J2:DACK6) X5.D13(-J2:DRQ6) X5.D14(-J2:DACK7) X5.D15(-J2:DRQ7) X5.D17(-J2:MASTER)

### Notes on the sheet
- Fiducials

## Library data of the parts
+5V +12V -12V GND TP1-TP4 = wirepad:SMD2: SMD PAD
C1 C14 C27 C40 = resistor:CPOL-US: POLARIZED CAPACITOR, American symbol
C2-C13 C15-C26 C28-C39 C41-C58 = resistor:C-EU: CAPACITOR, European symbol
D1 D4 D7 D10 = diode:ZENER-DIODE: Z-Diode
D2 D3 D5 D6 D8 D9 D11 D12 = diode:DIODE-: DIODE
F1-F6 = adafruit:FIDUCIAL: For use by pick and place machines to calibrate the vision/machine, 1mm By microbuilder.eu
J3 = con-lstb:MA03-2: PIN HEADER; OC_FARNELL: unknown; OC_NEWARK: unknown
J4-J7 = SparkFun-Connectors:M02: Standard 2-pin 0.1" header. Use with - straight break away headers ( PRT-00116) - right angle break away headers (PRT-00553) - swiss pins (PRT-00743) - machine pins (PRT-00117) - female headers (PRT-00115) Molex polarized connector foot print use with: PRT-08233 with associated crimp pins and housings. 2.54_SCREWTERM for use with PRT-10571. 3.5mm Screw Terminal footprints for PRT-08084 5mm Screw Terminal footprints for use with PRT-08433
Q1-Q4 = transistor-neu-to92:*-NPN-: NPN Transistror
R1-R4 R6-R14 R16-R24 R26-R34 R36-R41 = resistor:R-US_: RESISTOR, American symbol
R5 R15 R25 R35 = pot:TRIM_US-: POTENTIOMETER
SJ1-SJ4 = jumper:SJ: SMD solder JUMPER
U1 U4 U7 U10 = ic-package:DIL16: Dual In Line / Socket
U2 U5 U8 U11 = analog-devices:AD847ARZ
U3 U6 U9 U12 = analog-devices:AD843AQ
U13 = HAXDT_CUSTOM:ADS8634
X1-X4 = adafruit:ANTENNA_U.FL: U.FL Antenna Connector
X5 = con-pc104:PC104_MODIFIED

## Board
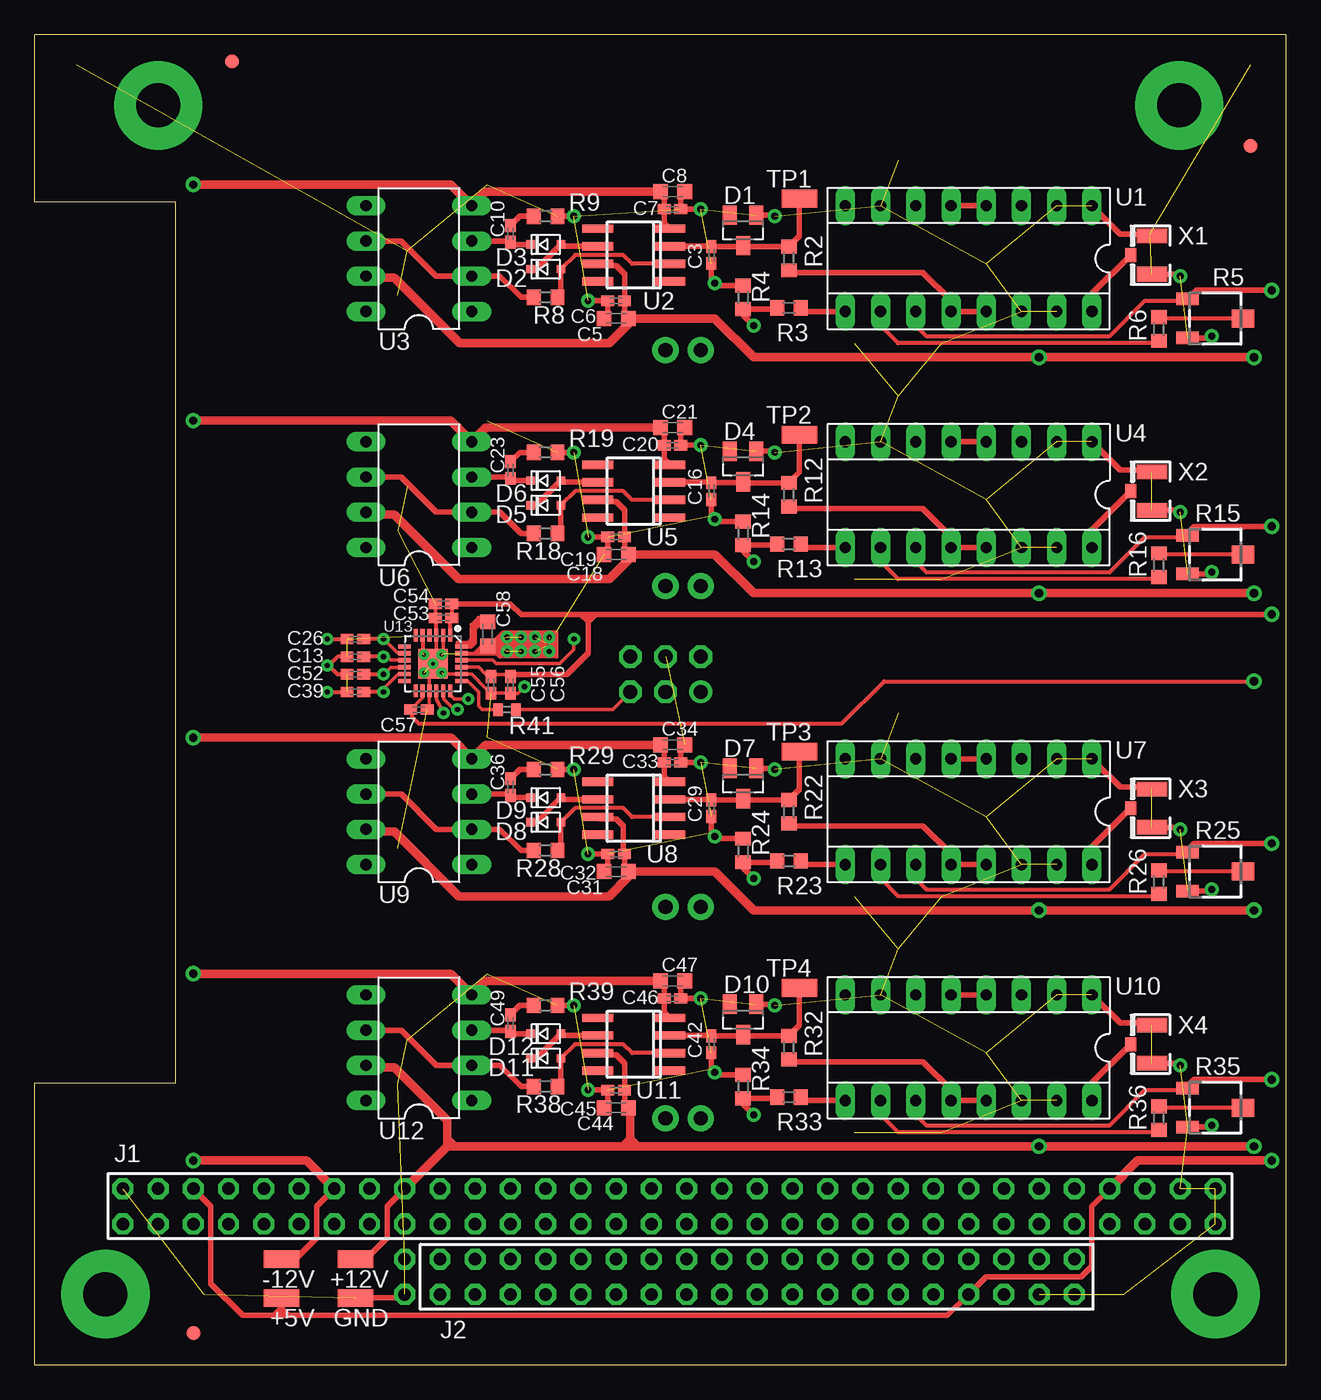
[diagram p6: board, top side]
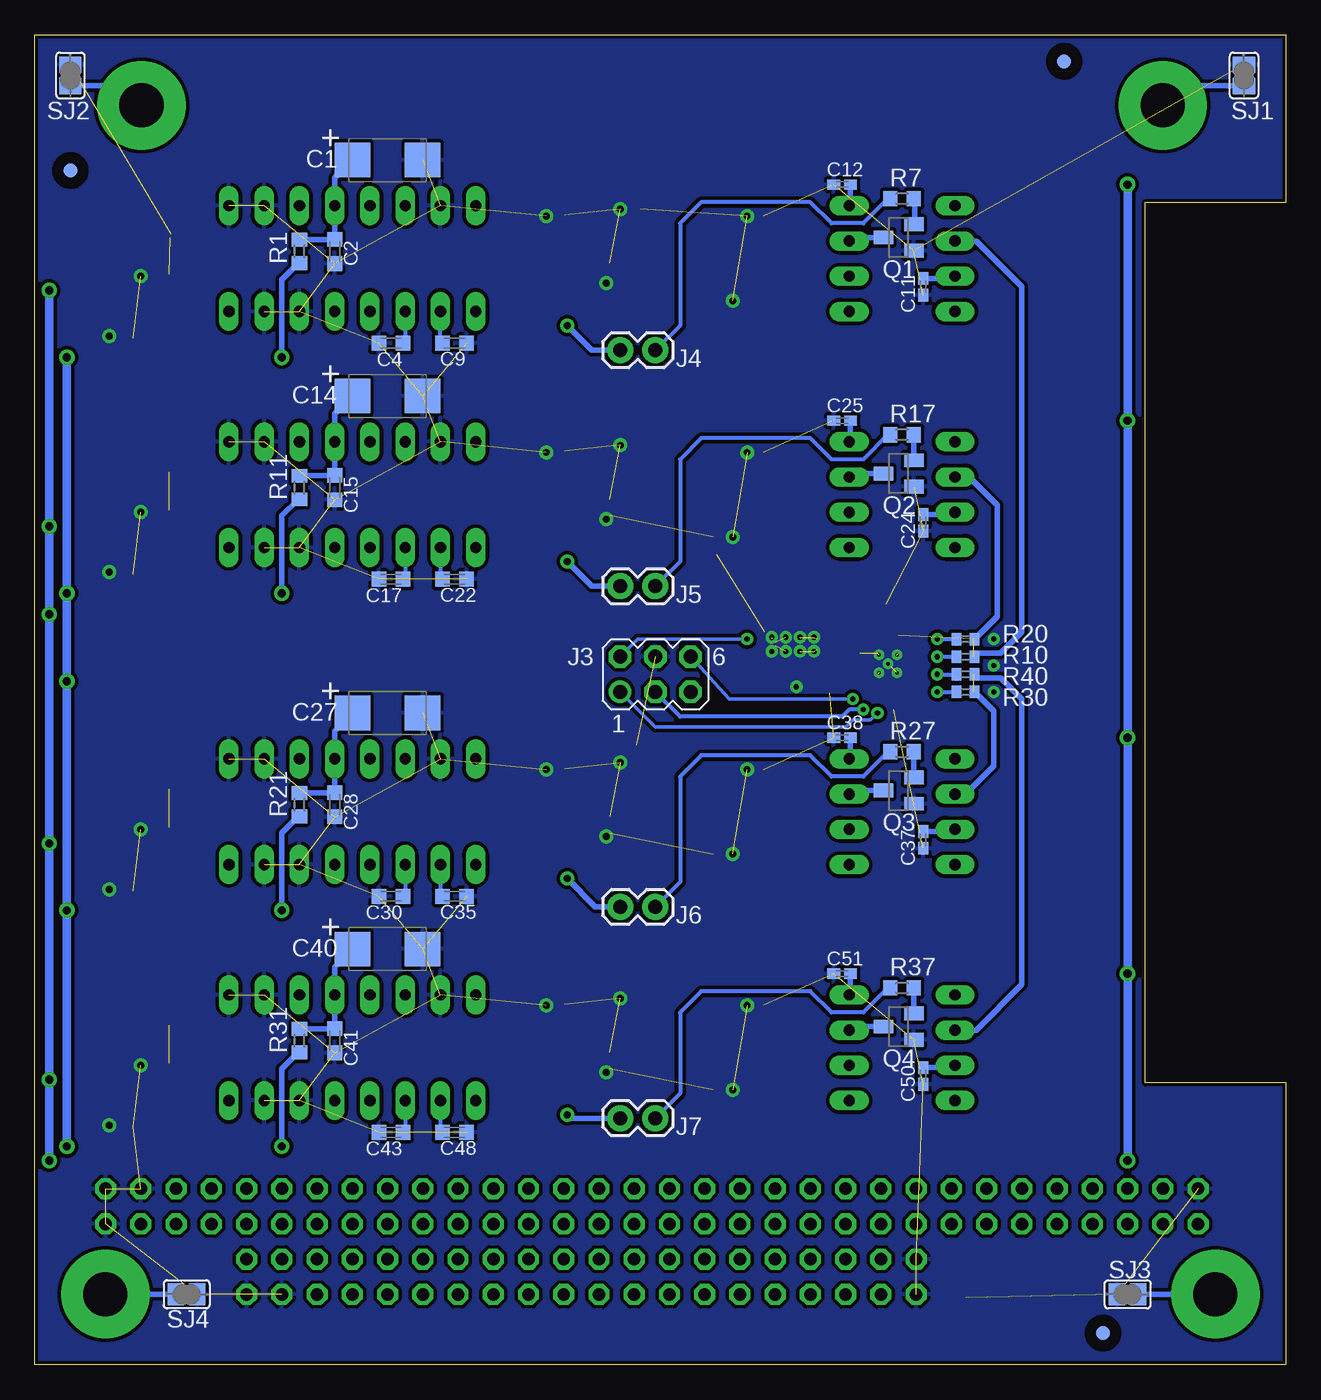
[diagram p7: board, bottom side, seen from below]

Size 90.2 x 95.9 mm. Coordinates in mm from the lower left corner, seen from the top.
Copper layers (1*16): Top 0.035mm / dielectric 1.5mm / Bottom 0.035mm
Design rules "AdvancedCircuits *": minimum track width 6mil, minimum drill 10mil, track to track 6mil, track to pad 6mil, pad to pad 6mil, via to via 6mil, smd to smd 6mil, copper to edge 10mil, drill to drill 6mil, minimum pad ring 12mil, minimum via ring 10mil, stop-mask expansion 4mil, vias tented up to drill 25mil, thermal gap 10mil

### Footprints (pad centres in the part's own frame; a part is rotated, then mirrored left to right if it is on the bottom)
SMD1,27-2,54 = smd 1.27 x 2.54: 1 0,0
C/6032-28R = smd 2.55 x 2.5: + 2.525,0; - -2.525,0
C0603K = smd 1.05 x 1.08: 1 -0.875,0; 2 0.875,0
C0402K = smd 0.925 x 0.74: 1 -0.6,0; 2 0.6,0
SOT23 = smd 1 x 1.4: 1 -0.95,-1.1; 2 0.95,-1.1; 3 0,1.1
SOD323-R = smd 0.6 x 0.6: A 1.1,0; C -1.1,0
FIDUCIAL_1MM = smd 1 x 1: 1 0,0
MA03-2 = drill 1.016: 1 -2.54,-1.27 | drill 1.016 octagon: 2 -2.54,1.27; 3 0,-1.27; 4 0,1.27; 5 2.54,-1.27; 6 2.54,1.27
1X02 = drill 1.016 pad 1.88: 1 0,0; 2 2.54,0
SOT23-EBC = smd 1 x 1.4: B 0.95,-1.1; C 0,1.1; E -0.95,-1.1
R0603 = smd 1 x 1.1: 1 -0.85,0; 2 0.85,0
3223J = smd 1.6 x 0.9: 1 -2,1.4; 3 -2,-1.4 | smd 1.6 x 1.3: 2 2,0
R0402 = smd 0.7 x 0.9: 1 -0.65,0; 2 0.65,0
SJ = smd 1.168 x 1.6: 1 -0.762,0; 2 0.762,0
SOCKET-16 = drill 0.813 long: 1 -8.89,-3.81; 2 -6.35,-3.81; 3 -3.81,-3.81; 4 -1.27,-3.81; 5 1.27,-3.81; 6 3.81,-3.81; 7 6.35,-3.81; 8 8.89,-3.81; 9 8.89,3.81; 10 6.35,3.81; 11 3.81,3.81; 12 1.27,3.81; 13 -1.27,3.81; 14 -3.81,3.81; 15 -6.35,3.81; 16 -8.89,3.81
SO8 = smd 0.6 x 2.2: 1 -1.905,-2.6; 2 -0.635,-2.6; 3 0.635,-2.6; 4 1.905,-2.6; 5 1.905,2.6; 6 0.635,2.6; 7 -0.635,2.6; 8 -1.905,2.6
DIL08 = drill 0.813 long: 1 -3.81,-3.81; 2 -1.27,-3.81; 3 1.27,-3.81; 4 3.81,-3.81; 5 3.81,3.81; 6 1.27,3.81; 7 -1.27,3.81; 8 -3.81,3.81
QFN24 = smd 0.9 x 0.3: 1 -2.05,1.25; 2 -2.05,0.75; 3 -2.05,0.25; 4 -2.05,-0.25; 5 -2.05,-0.75; 6 -2.05,-1.25; 13 1.95,-1.25; 14 1.95,-0.75; 15 1.95,-0.25; 16 1.95,0.25; 17 1.95,0.75; 18 1.95,1.25 | smd 0.3 x 0.9: 7 -1.25,-2.05; 8 -0.75,-2.05; 9 -0.25,-2.05; 10 0.25,-2.05; 11 0.75,-2.05; 12 1.25,-2.05; 19 1.25,2.05; 20 0.75,2.05; 21 0.25,2.05; 22 -0.25,2.05; 23 -0.75,2.05; 24 -1.25,2.05 | smd 2.1 x 2.1: EP 0,0
U.FL = smd 2.2 x 1.05: 1 0,1.375; 2 0,-1.375 | smd 0.8 x 1: 3 1.525,0
PC104_MODIFIED = drill 0.9 pad 1.397 octagon: A1 6.35,10.16; A2 8.89,10.16; A3 11.43,10.16; A4 13.97,10.16; A5 16.51,10.16; A6 19.05,10.16; A7 21.59,10.16; A8 24.13,10.16; A9 26.67,10.16; A10 29.21,10.16; A11 31.75,10.16; A12 34.29,10.16; A13 36.83,10.16; A14 39.37,10.16; A15 41.91,10.16; A16 44.45,10.16; A17 46.99,10.16; A18 49.53,10.16; A19 52.07,10.16; A20 54.61,10.16; A21 57.15,10.16; A22 59.69,10.16; A23 62.23,10.16; A24 64.77,10.16; A25 67.31,10.16; A26 69.85,10.16; A27 72.39,10.16; A28 74.93,10.16; A29 77.47,10.16; A30 80.01,10.16; A31 82.55,10.16; A32 85.09,10.16; B1 6.35,12.7; B2 8.89,12.7; B3 11.43,12.7; B4 13.97,12.7; B5 16.51,12.7; B6 19.05,12.7; B7 21.59,12.7; B8 24.13,12.7; B9 26.67,12.7; B10 29.21,12.7; B11 31.75,12.7; B12 34.29,12.7; B13 36.83,12.7; B14 39.37,12.7; B15 41.91,12.7; B16 44.45,12.7; B17 46.99,12.7; B18 49.53,12.7; B19 52.07,12.7; B20 54.61,12.7; B21 57.15,12.7; B22 59.69,12.7; B23 62.23,12.7; B24 64.77,12.7; B25 67.31,12.7; B26 69.85,12.7; B27 72.39,12.7; B28 74.93,12.7; B29 77.47,12.7; B30 80.01,12.7; B31 82.55,12.7; B32 85.09,12.7; C0 26.67,7.62; C1 29.21,7.62; C2 31.75,7.62; C3 34.29,7.62; C4 36.83,7.62; C5 39.37,7.62; C6 41.91,7.62; C7 44.45,7.62; C8 46.99,7.62; C9 49.53,7.62; C10 52.07,7.62; C11 54.61,7.62; C12 57.15,7.62; C13 59.69,7.62; C14 62.23,7.62; C15 64.77,7.62; C16 67.31,7.62; C17 69.85,7.62; C18 72.39,7.62; C19 74.93,7.62; D0 26.67,5.08; D1 29.21,5.08; D2 31.75,5.08; D3 34.29,5.08; D4 36.83,5.08; D5 39.37,5.08; D6 41.91,5.08; D7 44.45,5.08; D8 46.99,5.08; D9 49.53,5.08; D10 52.07,5.08; D11 54.61,5.08; D12 57.15,5.08; D13 59.69,5.08; D14 62.23,5.08; D15 64.77,5.08; D16 67.31,5.08; D17 69.85,5.08; D18 72.39,5.08; D19 74.93,5.08 | drill 3.175 pad 6.35: GND@1 8.9,90.8; GND@2 82.5,90.8; GND@3 5.1,5.1; GND@4 85.1,5.1

### Placement (x,y rotation side)
+5V  17.78,4.83 90 top
+12V  23.11,7.62 90 top
-12V  17.78,7.62 90 top
C1  64.77,86.87 180 bottom
C2  68.58,80.26 270 bottom
C3  48.77,80.01 270 top
C4  64.52,73.66 180 bottom
C5  41.91,75.44 180 top
C6  41.91,76.71 180 top
C7  45.97,83.31 0 top
C8  45.97,84.58 0 top
C9  59.94,73.66 0 bottom
C10  34.29,81.53 90 top
C11  26.16,77.72 270 bottom
C12  32,85.09 180 bottom
C13  23.11,51.05 180 top
C14  64.77,69.85 180 bottom
C15  68.58,63.25 270 bottom
C16  48.77,62.99 270 top
C17  64.52,56.64 180 bottom
C18  41.91,58.42 180 top
C19  41.91,59.69 180 top
C20  45.97,66.29 0 top
C21  45.97,67.56 0 top
C22  59.94,56.64 0 bottom
C23  34.29,64.52 90 top
C24  26.16,60.71 270 bottom
C25  32,68.07 180 bottom
C26  23.11,52.32 180 top
C27  64.77,46.99 180 bottom
C28  68.58,40.39 270 bottom
C29  48.77,40.13 270 top
C30  64.52,33.78 180 bottom
C31  41.91,35.56 180 top
C32  41.91,36.83 180 top
C33  45.97,43.43 0 top
C34  45.97,44.7 0 top
C35  59.94,33.78 0 bottom
C36  34.29,41.66 90 top
C37  26.16,37.85 270 bottom
C38  32,45.21 180 bottom
C39  23.11,48.51 180 top
C40  64.77,29.97 180 bottom
C41  68.58,23.37 270 bottom
C42  48.77,23.11 270 top
C43  64.52,16.76 180 bottom
C44  41.91,18.54 180 top
C45  41.91,19.81 180 top
C46  45.97,26.42 0 top
C47  45.97,27.69 0 top
C48  59.94,16.76 0 bottom
C49  34.29,24.64 90 top
C50  26.16,20.83 270 bottom
C51  32,28.19 180 bottom
C52  23.11,49.78 180 top
C53  29.46,53.85 180 top
C54  29.46,54.86 180 top
C55  32.89,49.02 270 top
C56  34.29,49.02 270 top
C57  27.69,47.24 0 top
C58  32.64,52.7 270 top
D1  51.05,81.79 180 top
D2  36.83,78.99 0 top
D3  36.83,80.77 0 top
D4  51.05,64.77 180 top
D5  36.83,61.98 0 top
D6  36.83,63.75 0 top
D7  51.05,41.91 180 top
D8  36.83,39.12 0 top
D9  36.83,40.89 0 top
D10  51.05,24.89 180 top
D11  36.83,22.1 0 top
D12  36.83,23.88 0 top
F1  11.43,2.29 0 top
F2  14.22,93.98 0 top
F3  87.63,87.88 0 top
F4  13.21,2.29 0 bottom
F5  16,93.98 0 bottom
F6  87.63,86.11 0 bottom
GND  23.11,4.83 90 top
J3  45.47,49.78 0 bottom
J4  48.01,73.15 0 bottom
J5  48.01,56.13 0 bottom
J6  48.01,33.02 0 bottom
J7  48.01,17.78 0 bottom
Q1  27.94,81.28 90 bottom
Q2  27.94,64.26 90 bottom
Q3  27.94,41.4 90 bottom
Q4  27.94,24.38 90 bottom
R1  71.12,80.26 90 bottom
R2  54.36,79.76 90 top
R3  54.36,76.2 180 top
R4  51.05,76.96 270 top
R5  85.09,75.44 0 top
R6  81.03,74.68 90 top
R7  27.69,84.07 0 bottom
R8  36.83,76.96 180 top
R9  36.83,82.8 180 top
R10  23.11,51.05 180 bottom
R11  71.12,63.25 90 bottom
R12  54.36,62.74 90 top
R13  54.36,59.18 180 top
R14  51.05,59.94 270 top
R15  85.09,58.42 0 top
R16  81.03,57.66 90 top
R17  27.69,67.06 0 bottom
R18  36.83,59.94 180 top
R19  36.83,65.79 180 top
R20  23.11,52.32 180 bottom
R21  71.12,40.39 90 bottom
R22  54.36,39.88 90 top
R23  54.36,36.32 180 top
R24  51.05,37.08 270 top
R25  85.09,35.56 0 top
R26  81.03,34.8 90 top
R27  27.69,44.2 0 bottom
R28  36.83,37.08 180 top
R29  36.83,42.93 180 top
R30  23.11,48.51 180 bottom
R31  71.12,23.37 90 bottom
R32  54.36,22.86 90 top
R33  54.36,19.3 180 top
R34  51.05,20.07 270 top
R35  85.09,18.54 0 top
R36  81.03,17.78 90 top
R37  27.69,27.18 0 bottom
R38  36.83,20.07 180 top
R39  36.83,25.91 180 top
R40  23.11,49.78 180 bottom
R41  34.04,47.24 0 top
SJ1  3.05,92.96 270 bottom
SJ2  87.63,92.96 270 bottom
SJ3  11.43,5.08 0 bottom
SJ4  79.25,5.08 180 bottom
TP1  55.12,84.07 270 top
TP2  55.12,67.06 270 top
TP3  55.12,44.2 270 top
TP4  55.12,27.18 270 top
U1  67.31,79.76 180 top
U2  43.18,80.01 90 top
U3  27.69,79.76 90 top
U4  67.31,62.74 180 top
U5  43.18,62.99 90 top
U6  27.69,62.74 90 top
U7  67.31,39.88 180 top
U8  43.18,40.13 90 top
U9  27.69,39.88 90 top
U10  67.31,22.86 180 top
U11  43.18,23.11 90 top
U12  27.69,22.86 90 top
U13  28.7,50.55 270 top
X1  80.52,80.01 180 top
X2  80.52,62.99 180 top
X3  80.52,40.13 180 top
X4  80.52,23.11 180 top
X5  0,0 0 top

### Tracks (layer width: path | path; a pad name or v marks a point on that pad's centre or on a via)
+5V  (via drill 0.6)  (1 unrouted)
  Top 0.254: U13.21 32,50.3 32.51,49.78 32.98,49.78 C55.1 32.89,49.91 33.02,49.78 34.13,49.78 C56.1
  Top 0.305: U1.11 63.5,74.93 64.26,74.17 77.47,74.17 80.01,76.71 82.96,76.71 R5.1 | U4.11 63.5,57.91 64.26,57.15 77.47,57.15 80.01,59.69 82.96,59.69 R15.1 | U7.11 63.5,35.05 64.26,34.29 77.47,34.29 80.01,36.83 82.96,36.83 R25.1 | U10.11 63.5,18.03 64.26,17.27 77.47,17.27 80.01,19.81 82.96,19.81 R35.1 | U13.1 29.95,53.74 C53.1 C54.1
  Top 0.406: R5.1 83.72,77.47 v89.15,77.47 | R15.1 83.09,59.98 83.57,60.45 v89.15,60.45 | R25.1 83.09,37.12 83.57,37.59 v89.15,37.59 | R35.1 83.09,20.1 83.57,20.57 v89.15,20.57 | 34.29,49.78 34.45,49.78 | C54.1 34.29,54.86 35.05,54.1 39.37,54.1 | 39.37,54.1 39.88,54.1 | 39.88,54.1 40.39,54.1 | 34.45,49.78 38.35,49.78 39.88,51.31 39.88,53.59 | 34.45,49.78 C56.1 | 39.88,53.59 39.88,54.1 | 39.37,54.1 39.88,53.59 | 39.88,53.59 40.39,54.1 | 40.39,54.1 v89.15,54.1 | X5.B3 12.7,11.43 12.7,5.84 14.99,3.56 17.27,3.56 | 17.27,3.56 17.78,3.56 | 17.78,3.56 18.29,3.56 | 18.29,3.56 65.79,3.56 X5.D16 68.58,6.35 75.44,6.35 76.2,7.11 76.2,11.43 X5.B29 | +5V.1 17.78,4.06 | 17.78,4.06 17.78,3.56 | 17.27,3.56 17.78,4.06 | 17.78,4.06 18.29,3.56
  Top 0.61: X5.B29 79.5,14.73 v89.15,14.73
  Bottom 0.305: U1.11 63.5,73.8 C4.1 | 63.5,56.9 63.75,56.64 | U4.11 63.5,56.78 C17.1 | U7.11 63.5,33.92 C30.1 | U10.11 63.5,16.91 C43.1
  Bottom 0.61: v89.15,77.47 v89.15,60.45 v89.15,54.1 v89.15,37.59 v89.15,20.57 v89.15,14.73
+12V  (via drill 0.6)
  Top 0.254: U13.14 27.95,48.11 C57.1
  Top 0.305: v87.88,49.28 61.21,49.28 58.17,46.23 27.69,46.23 27.18,46.74 27.18,47.24 C57.1
  Top 0.406: C5.1 42.51,75.71 C6.1 42.51,78.65 41.91,79.25 40.71,79.25 U2.7 | C18.1 42.51,58.7 C19.1 42.51,61.63 41.91,62.23 40.71,62.23 U5.7 | C31.1 42.51,35.84 C32.1 42.42,36.83 42.42,38.86 41.91,39.37 40.71,39.37 U8.7 | C44.1 42.51,18.82 C45.1 42.51,21.75 41.91,22.35 40.71,22.35 U11.7 | +12V.1 24.13,7.87 25.4,9.14 25.4,11.43 X5.B9
  Top 0.61: U3.7 23.97,78.39 25.91,78.39 30.64,73.66 41.4,73.66 42.78,75.04 C5.1 49.02,75.44 51.82,72.64 v72.39,72.64 v87.88,72.64 | X5.B9 29.72,15.75 | v87.88,15.75 v72.39,15.75 43.43,15.75 | 43.43,15.75 42.42,15.75 | 42.42,15.75 30.23,15.75 | 30.23,15.75 29.72,15.75 | v87.88,55.63 v72.39,55.63 51.82,55.63 49.02,58.42 C18.1 42.78,58.02 41.4,56.64 30.57,56.64 25.91,61.31 24.04,61.31 U6.7 | v87.88,32.77 v72.39,32.77 51.82,32.77 49.02,35.56 C31.1 42.78,35.16 41.4,33.78 30.57,33.78 25.91,38.45 24.04,38.45 U9.7 | U12.7 24.04,21.43 25.91,21.43 29.72,17.62 29.72,16.26 | 29.72,16.26 29.72,15.75 | 29.72,16.26 30.23,15.75 | 42.42,15.75 42.93,16.26 | 42.93,16.26 42.93,18.4 C44.1 | 42.93,16.26 43.43,15.75
  Bottom 0.406: R1.1 71.21,79.41 72.39,78.23 v72.39,72.64 | C11.1 24.04,78.32 U3.7 | C24.1 24.04,61.31 U6.7 | C37.1 24.04,38.45 U9.7 | C50.1 24.04,21.43 U12.7 | v72.39,55.63 72.39,61.21 71.21,62.4 R11.1 | R21.1 71.21,39.54 72.39,38.35 v72.39,32.77 | R31.1 71.21,22.52 72.39,21.34 v72.39,15.75
  Bottom 0.61: v87.88,72.64 v87.88,55.63 v87.88,49.28 v87.88,32.77 v87.88,15.75
-12V  (via drill 0.6)
  Top 0.406: U2.4 45.37,82.32 C7.1 45.37,84.31 C8.1 | C21.1 45.37,67.29 C20.1 45.37,65.3 U5.4 | C34.1 45.37,44.43 C33.1 45.37,42.44 U8.4 | C47.1 45.37,27.41 C46.1 45.37,25.43 U11.4 | -12V.1 18.8,7.62 20.32,9.14 20.32,11.43 X5.B7
  Top 0.61: X5.B7 19.56,14.73 v11.43,14.73 | C8.1 32.51,84.58 U3.4 29.97,85.09 v11.43,85.09 | C21.1 32.51,67.56 U6.4 29.97,68.07 v11.43,68.07 | C34.1 32.51,44.7 U9.4 29.97,45.21 v11.43,45.21 | C47.1 32.51,27.69 U12.4 29.97,28.19 v11.43,28.19
  Bottom 0.406: C12.1 31.4,83.66 U3.4 | C25.1 31.4,66.64 U6.4 | C38.1 31.4,43.78 U9.4 | C51.1 31.4,26.76 U12.4
  Bottom 0.61: v11.43,14.73 v11.43,28.19 v11.43,45.21 v11.43,68.07 v11.43,85.09
A225_OUT1
  Top 0.406: U1.16 76.2,77.22 X1.3
A225_OUT2
  Top 0.406: X2.3 76.2,60.2 U4.16
A225_OUT3
  Top 0.406: X3.3 76.2,37.34 U7.16
A225_OUT4
  Top 0.406: X4.3 76.2,20.32 U10.16
AL_PD  (via drill 0.38)
  Top 0.254: U13.22 33.02,50.8 33.27,50.55 37.85,50.55 38.86,51.56 v38.86,52.32 | 30.73,50.8 U13.22 | U13.22
  Bottom 0.254: v38.86,52.32 46.74,52.32 J3.2
AMPOUT1
  Top 0.406: U1.13 U1.12 66.04,76.71 64.01,78.74 54.52,78.74 R2.1
AMPOUT2
  Top 0.406: U4.13 U4.12 66.04,59.69 64.01,61.72 54.52,61.72 R12.1
AMPOUT3
  Top 0.406: U7.13 U7.12 66.04,36.83 64.01,38.86 54.52,38.86 R22.1
AMPOUT4
  Top 0.406: U10.13 U10.12 66.04,19.81 64.01,21.84 54.52,21.84 R32.1
CS  (via drill 0.38)
  Top 0.254: v29.46,46.99 28.96,48.01 U13.16
  Bottom 0.254: v29.46,46.99 29.97,46.48 31.24,46.48 31.75,45.97 45.47,45.97 J3.1
DIN  (via drill 0.38)
  Top 0.254: v31.24,48.01 30.23,48.01 29.97,48.26 29.97,48.58 U13.18
  Bottom 0.254: v31.24,48.01 40.13,48.01 J3.6
DISCRIMINATOR1  (via drill 0.5)
  Top 0.406: R3.2 53.42,76.11 R4.2 51.05,75.69 v51.82,74.93
  Bottom 0.406: v51.82,74.93 50.04,73.15 J4.1
DISCRIMINATOR2  (via drill 0.5)
  Top 0.406: R13.2 53.42,59.09 R14.2 51.05,58.67 v51.82,57.91
  Bottom 0.406: v51.82,57.91 50.04,56.13 J5.1
DISCRIMINATOR3  (via drill 0.5)
  Top 0.406: R23.2 53.42,36.23 R24.2 51.05,35.81 v51.82,35.05
  Bottom 0.406: v51.82,35.05 49.78,33.02 J6.1
DISCRIMINATOR4  (via drill 0.5)
  Top 0.406: R33.2 53.42,19.22 R34.2 51.05,18.8 v51.82,18.03
  Bottom 0.406: v51.82,18.03 51.56,17.78 J7.1
DOUT
  Top 0.254: R41.2 41.66,47.24 J3.5
GND  (via drill 0.25 pad 0.51, 0.38, 0.5)  (104 unrouted)
  Top 0.254: U13.EP 28.45,50.3 U13.15 28.45,47.41 C57.2 | U13.3 28.95,50.8 | U13.2 29.45,51.3 | 29.45,49.8 U13.20 31.48,49.8 32.51,48.77 | 32.51,48.77 32.8,48.51 C55.2 C56.2 | 32.51,48.77 32.77,48.51 | C56.2 34.29,48.51 34.42,48.39 34.8,48.39 v35.31,48.9 | C56.2 34.29,48.77
  Top 0.305: v21.08,52.32 C26.2 | v21.08,48.51 C39.2 | C13.2 21.84,51.05 21.21,50.42 | C52.2 21.84,49.78 21.21,50.42 | v21.08,50.42 21.21,50.42 | U13.3 28.95,53.76 C53.2 C54.2 | 28.95,50.8 U13.EP | 29.45,51.3 U13.EP | U13.5 27.95,51.3 U13.EP | 29.45,49.8 U13.EP | 32.1,51.3 C58.2 33.16,51.31 33.27,51.31 | U13.23 32.26,51.3 | 32.26,51.3 33.26,51.3 33.27,51.31 | 33.27,52.32 33.78,52.83 37.59,52.83 37.59,51.05 33.53,51.05 33.27,51.31 | 33.27,51.31 33.27,52.07 33.78,52.58 37.34,52.58 37.34,51.31 33.53,51.31 33.53,52.07 33.78,52.32 37.08,52.32 37.08,51.56 | 37.08,51.56 33.78,51.56 33.78,52.07 36.83,52.07 36.83,51.82 34.04,51.82 | v37.08,51.44 37.08,51.56 | 32.26,51.82 31.75,51.31 32.25,51.31 32.26,51.3
  Top 0.406: 80.41,81.28 X1.2 80.37,81.53 78.23,81.53 U1.1 | R4.1 49.19,77.81 v49.02,77.98 48.77,78.23 C3.2 | C5.2 41.31,75.71 C6.2 v39.88,76.71 | C8.2 46.57,84.31 C7.2 v48.01,83.31 | R9.1 v38.86,82.8 | R5.3 84.71,74.04 v84.84,74.17 | R15.3 84.71,57.02 v84.84,57.15 | R25.3 84.71,34.16 v84.84,34.29 | R35.3 84.71,17.14 v84.84,17.27 | U4.1 78.23,64.52 80.37,64.52 X2.2 | U7.1 78.23,41.66 80.37,41.66 X3.2 | U10.1 78.23,24.64 80.37,24.64 X4.2 | D4.1 53.26,65.87 v53.34,65.79 | D7.1 53.26,43.01 v53.34,42.93 | D10.1 53.26,25.99 v53.34,25.91 | C16.2 48.77,61.21 v49.02,60.96 49.19,60.79 R14.1 | C29.2 48.77,38.35 v49.02,38.1 49.19,37.93 R24.1 | C42.2 48.77,21.34 v49.02,21.08 49.19,20.92 R34.1 | C21.2 46.57,67.29 C20.2 v48.01,66.29 | v39.88,59.69 C19.2 41.31,58.7 C18.2 | C34.2 46.57,44.43 C33.2 v48.01,43.43 | C31.2 41.31,35.84 C32.2 v39.88,36.83 | C47.2 46.57,27.41 C46.2 v48.01,26.42 | v39.88,19.81 C45.2 41.31,18.82 C44.2 | R19.1 v38.86,65.79 | R29.1 v38.86,42.93 | R39.1 v38.86,25.91 | GND.1 26.42,4.83 X5.D0 | X4.1 82.4,21.74 v82.55,21.59 | X3.1 82.4,38.76 v82.55,38.61 | X2.1 82.4,61.62 v82.55,61.47 | D1.1 53.26,82.89 v53.34,82.8 | X1.1 82.4,78.64 v82.55,78.49
  other vias: 28.07,51.18 29.34,51.18 29.34,49.91 28.07,49.91 28.7,50.55 34.04,52.45 34.04,51.44 35.05,52.45 35.05,51.44 36.07,51.44 36.07,52.45 37.08,52.45
  pour Bottom (isolate 0.254): 0,0 90.17,0 90.17,96.01 0,96.01 0,83.82 10.16,83.82 10.16,20.32 0,20.32
N$1
  Top 0.406: U4.5 U4.4
  Bottom 0.406: C14.+ 68.58,68.56 U4.4 C15.1 68.86,64.1 R11.2
N$2
  Top 0.406: U4.9 55.46,58.93 R13.1
N$3
  Top 0.305: R15.2 81.11,58.42 R16.2
N$4
  Top 0.406: U7.5 U7.4
  Bottom 0.406: C27.+ 68.58,45.7 U7.4 C28.1 68.86,41.24 R21.2
N$5
  Top 0.406: U7.9 55.46,36.07 R23.1
N$6
  Top 0.305: R25.2 81.11,35.56 R26.2
N$7
  Top 0.406: U10.5 U10.4
  Bottom 0.406: R31.2 68.86,24.22 C41.1 U10.4 68.58,28.69 C40.+
N$8
  Top 0.406: U10.9 55.46,19.05 R33.1
N$9
  Top 0.406: U1.5 U1.4
  Bottom 0.406: R1.2 68.86,81.11 C2.1 U1.4 68.58,85.58 C1.+
N$10
  Top 0.305: R35.2 81.11,18.54 R36.2
N$11
  Top 0.406: U2.3 48.73,80.64 C3.1 50.98,80.61 D1.3 51.14,80.61 R2.2 55.12,81.37 TP1.1
N$12
  Top 0.406: U1.9 55.46,75.95 R3.1
N$13
  Top 0.406: U2.6 38.06,80.64 D3.A 36.15,78.99 D2.C
N$14
  Top 0.305: R5.2 81.11,75.44 R6.2
N$15
  Top 0.305: U2.2 43.05,79.38 42.42,80.01 38.95,80.01 D2.A
  Top 0.406: D2.A 37.93,77.21 R8.1
N$16
  Top 0.406: U3.3 34.2,81.03 C10.1 34.45,80.77 D3.C
  Bottom 0.406: Q1.C 31.24,81.28 U3.3
N$17
  Top 0.406: R9.2 34.96,82.8 C10.2
N$18
  Bottom 0.406: Q1.B 26.77,82.3 26.77,84.01 R7.2
N$19
  Top 0.406: R8.2 35.05,76.96 33.53,78.49 U3.2 28.96,78.49 26.42,81.03 U3.6
  Bottom 0.406: R10.1 22.46,51.2 22.35,51.31 20.57,51.31 19.05,52.83 19.05,77.72 22.35,81.03 U3.6
N$20
  Top 0.406: TP2.1 55.12,64.35 R12.2 51.14,63.59 D4.3 50.98,63.59 C16.1 48.73,63.63 U5.3
N$21
  Top 0.406: U5.6 38.06,63.63 D6.A 36.15,61.98 D5.C
N$22
  Top 0.305: U5.2 43.05,62.36 42.42,62.99 38.95,62.99 D5.A
  Top 0.406: D5.A 37.93,60.19 R18.1
N$23
  Top 0.406: D6.C 34.45,63.75 C23.1 34.2,64.01 U6.3
  Bottom 0.406: Q2.C 31.24,64.26 U6.3
N$24
  Top 0.406: R19.2 34.96,65.79 C23.2
N$25
  Bottom 0.406: Q2.B R17.2
N$26
  Top 0.406: R18.2 35.05,59.94 33.53,61.47 U6.2 28.96,61.47 26.42,64.01 U6.6
  Bottom 0.406: U6.6 22.86,64.01 20.83,61.98 20.83,53.96 R20.1
N$27
  Top 0.406: TP3.1 55.12,41.49 R22.2 51.14,40.73 D7.3 50.98,40.73 C29.1 48.73,40.77 U8.3
N$28
  Top 0.406: U8.6 38.06,40.77 D9.A 36.15,39.12 D8.C
N$29
  Top 0.305: U8.2 43.05,39.5 42.42,40.13 38.95,40.13 D8.A
  Top 0.406: D8.A 37.93,37.33 R28.1
N$30
  Top 0.406: U9.3 34.2,41.15 C36.1 34.45,40.89 D9.C
  Bottom 0.406: Q3.C 31.24,41.4 U9.3
N$31
  Top 0.406: R29.2 34.96,42.93 C36.2
N$32
  Bottom 0.406: Q3.B R27.2
N$33
  Top 0.406: R28.2 35.05,37.08 33.53,38.61 U9.2 28.96,38.61 26.42,41.15 U9.6
  Bottom 0.406: U9.6 23.11,41.15 21.08,43.18 21.08,47.13 R30.1
N$34
  Top 0.406: TP4.1 55.12,24.47 R32.2 51.14,23.71 D10.3 50.98,23.71 C42.1 48.73,23.75 U11.3
N$35
  Top 0.406: U11.6 38.06,23.75 D12.A 36.15,22.1 D11.C
N$36
  Top 0.305: U11.2 43.05,22.48 42.42,23.11 38.95,23.11 D11.A
  Top 0.406: D11.A 37.93,20.32 R38.1
N$37
  Top 0.406: D12.C 34.45,23.88 C49.1 34.2,24.13 U12.3
  Bottom 0.406: Q4.C 31.24,24.38 U12.3
N$38
  Top 0.406: R39.2 34.96,25.91 C49.2
N$39
  Bottom 0.406: Q4.B R37.2
N$40
  Top 0.406: R38.2 35.05,20.07 33.53,21.59 U12.2 28.96,21.59 26.42,24.13 U12.6
  Bottom 0.406: U12.6 22.35,24.13 19.05,27.43 19.05,48.01 20.57,49.53 22.21,49.53 R40.1
N$43
  Bottom 0.406: SJ1.2 7.5,92.2 X5.GND@1
N$44
  Bottom 0.406: SJ2.2 83.9,92.2 X5.GND@2
N$45
  Bottom 0.406: SJ3.2 5.12,5.08 X5.GND@3
N$46
  Bottom 0.406: SJ4.2 85.08,5.08 X5.GND@4
N$47
  Top 0.254: U13.19 31.22,49.3 32,48.51 32,47.5 32.26,47.24 R41.1
PEAK1  (via drill 0.38)
  Top 0.254: 25.4,51.05 25.65,50.8 U13.9
  Top 0.305: C13.1 v25.15,51.05 25.4,51.05 | U13.9
  Bottom 0.305: v25.15,51.05 R10.2
PEAK2  (via drill 0.38)
  Top 0.254: v25.15,52.32 26.16,51.31 U13.8
  Top 0.305: v25.15,52.32 C26.1
  Bottom 0.305: v25.15,52.32 R20.2
PEAK3  (via drill 0.38)
  Top 0.254: v25.15,48.51 25.15,48.77 26.16,49.78 26.64,49.78 U13.11
  Top 0.305: v25.15,48.51 C39.1
  Bottom 0.305: v25.15,48.51 R30.2
PEAK4  (via drill 0.38)
  Top 0.254: v25.15,49.78 25.65,50.29 U13.10
  Top 0.305: v25.15,49.78 C52.1 | U13.10
  Bottom 0.305: v25.15,49.78 R40.2
REF
  Top 0.305: U13.24 31.48,51.8 31.75,52.07 31.75,52.32 | 31.75,52.32 31.75,53.09 32,53.34 32.4,53.34 C58.1 | 30.48,51.82 30.48,52.07 31.24,52.07 | 31.24,52.07 31.5,52.07 31.75,52.32 | 31.24,52.07 31.5,52.32 31.5,53.09 | 31.5,53.09 32.26,53.85 | 31.5,53.09 31.5,53.34 32,53.85 32.51,53.85
RESET1
  Bottom 0.305: R7.1 28.7,84.07 30.48,82.3 32.77,82.3 34.29,83.82 42.16,83.82 43.69,82.3 43.69,74.93 J4.2
RESET2
  Bottom 0.305: R17.1 28.7,67.06 30.48,65.28 32.77,65.28 34.29,66.8 42.16,66.8 43.69,65.28 43.69,57.91 J5.2
RESET3
  Bottom 0.305: R27.1 28.7,44.2 30.48,42.42 32.77,42.42 34.29,43.94 42.16,43.94 43.69,42.42 43.69,34.8 J6.2
RESET4
  Bottom 0.305: R37.1 28.7,27.18 30.48,25.4 32.77,25.4 34.29,26.92 42.16,26.92 43.69,25.4 43.69,19.56 J7.2
SCLK  (via drill 0.38)
  Top 0.254: v30.48,47.24 30.23,47.24 29.46,48.01 29.46,48.58 U13.17
  Bottom 0.305: v30.48,47.24 31.5,47.24 32,46.74 43.69,46.74 J3.3
VV1
  Top 0.305: R6.1 80.94,73.83 80.77,73.66 62.23,73.66 60.96,74.93 U1.10
  Bottom 0.305: C9.1 60.82,73.77 60.96,73.91 U1.10
VV2
  Top 0.305: R16.1 80.94,56.81 80.77,56.64 62.23,56.64 60.96,57.91 U4.10
  Bottom 0.305: U4.10 60.96,56.78 C22.1
VV3
  Top 0.305: R26.1 80.94,33.95 80.77,33.78 62.23,33.78 60.96,35.05 U7.10
  Bottom 0.305: U7.10 60.96,33.92 C35.1
VV4
  Top 0.305: R36.1 80.94,16.93 80.77,16.76 62.23,16.76 60.96,18.03 U10.10
  Bottom 0.305: U10.10 60.96,16.91 C48.1

### Text on the board
bPlace: + | + | + | +
tNames: U13
Document: University of Minnesota HASP / Detector Front End: Bottom Board | 1 | 1 | 1 | 1 | 1 | 1 | 1 | 1 | 2015 Rev 1.0